# Altium project RHR075_GFC_ECAT_DNET_RS485_ALL_rev5.PrjPcb
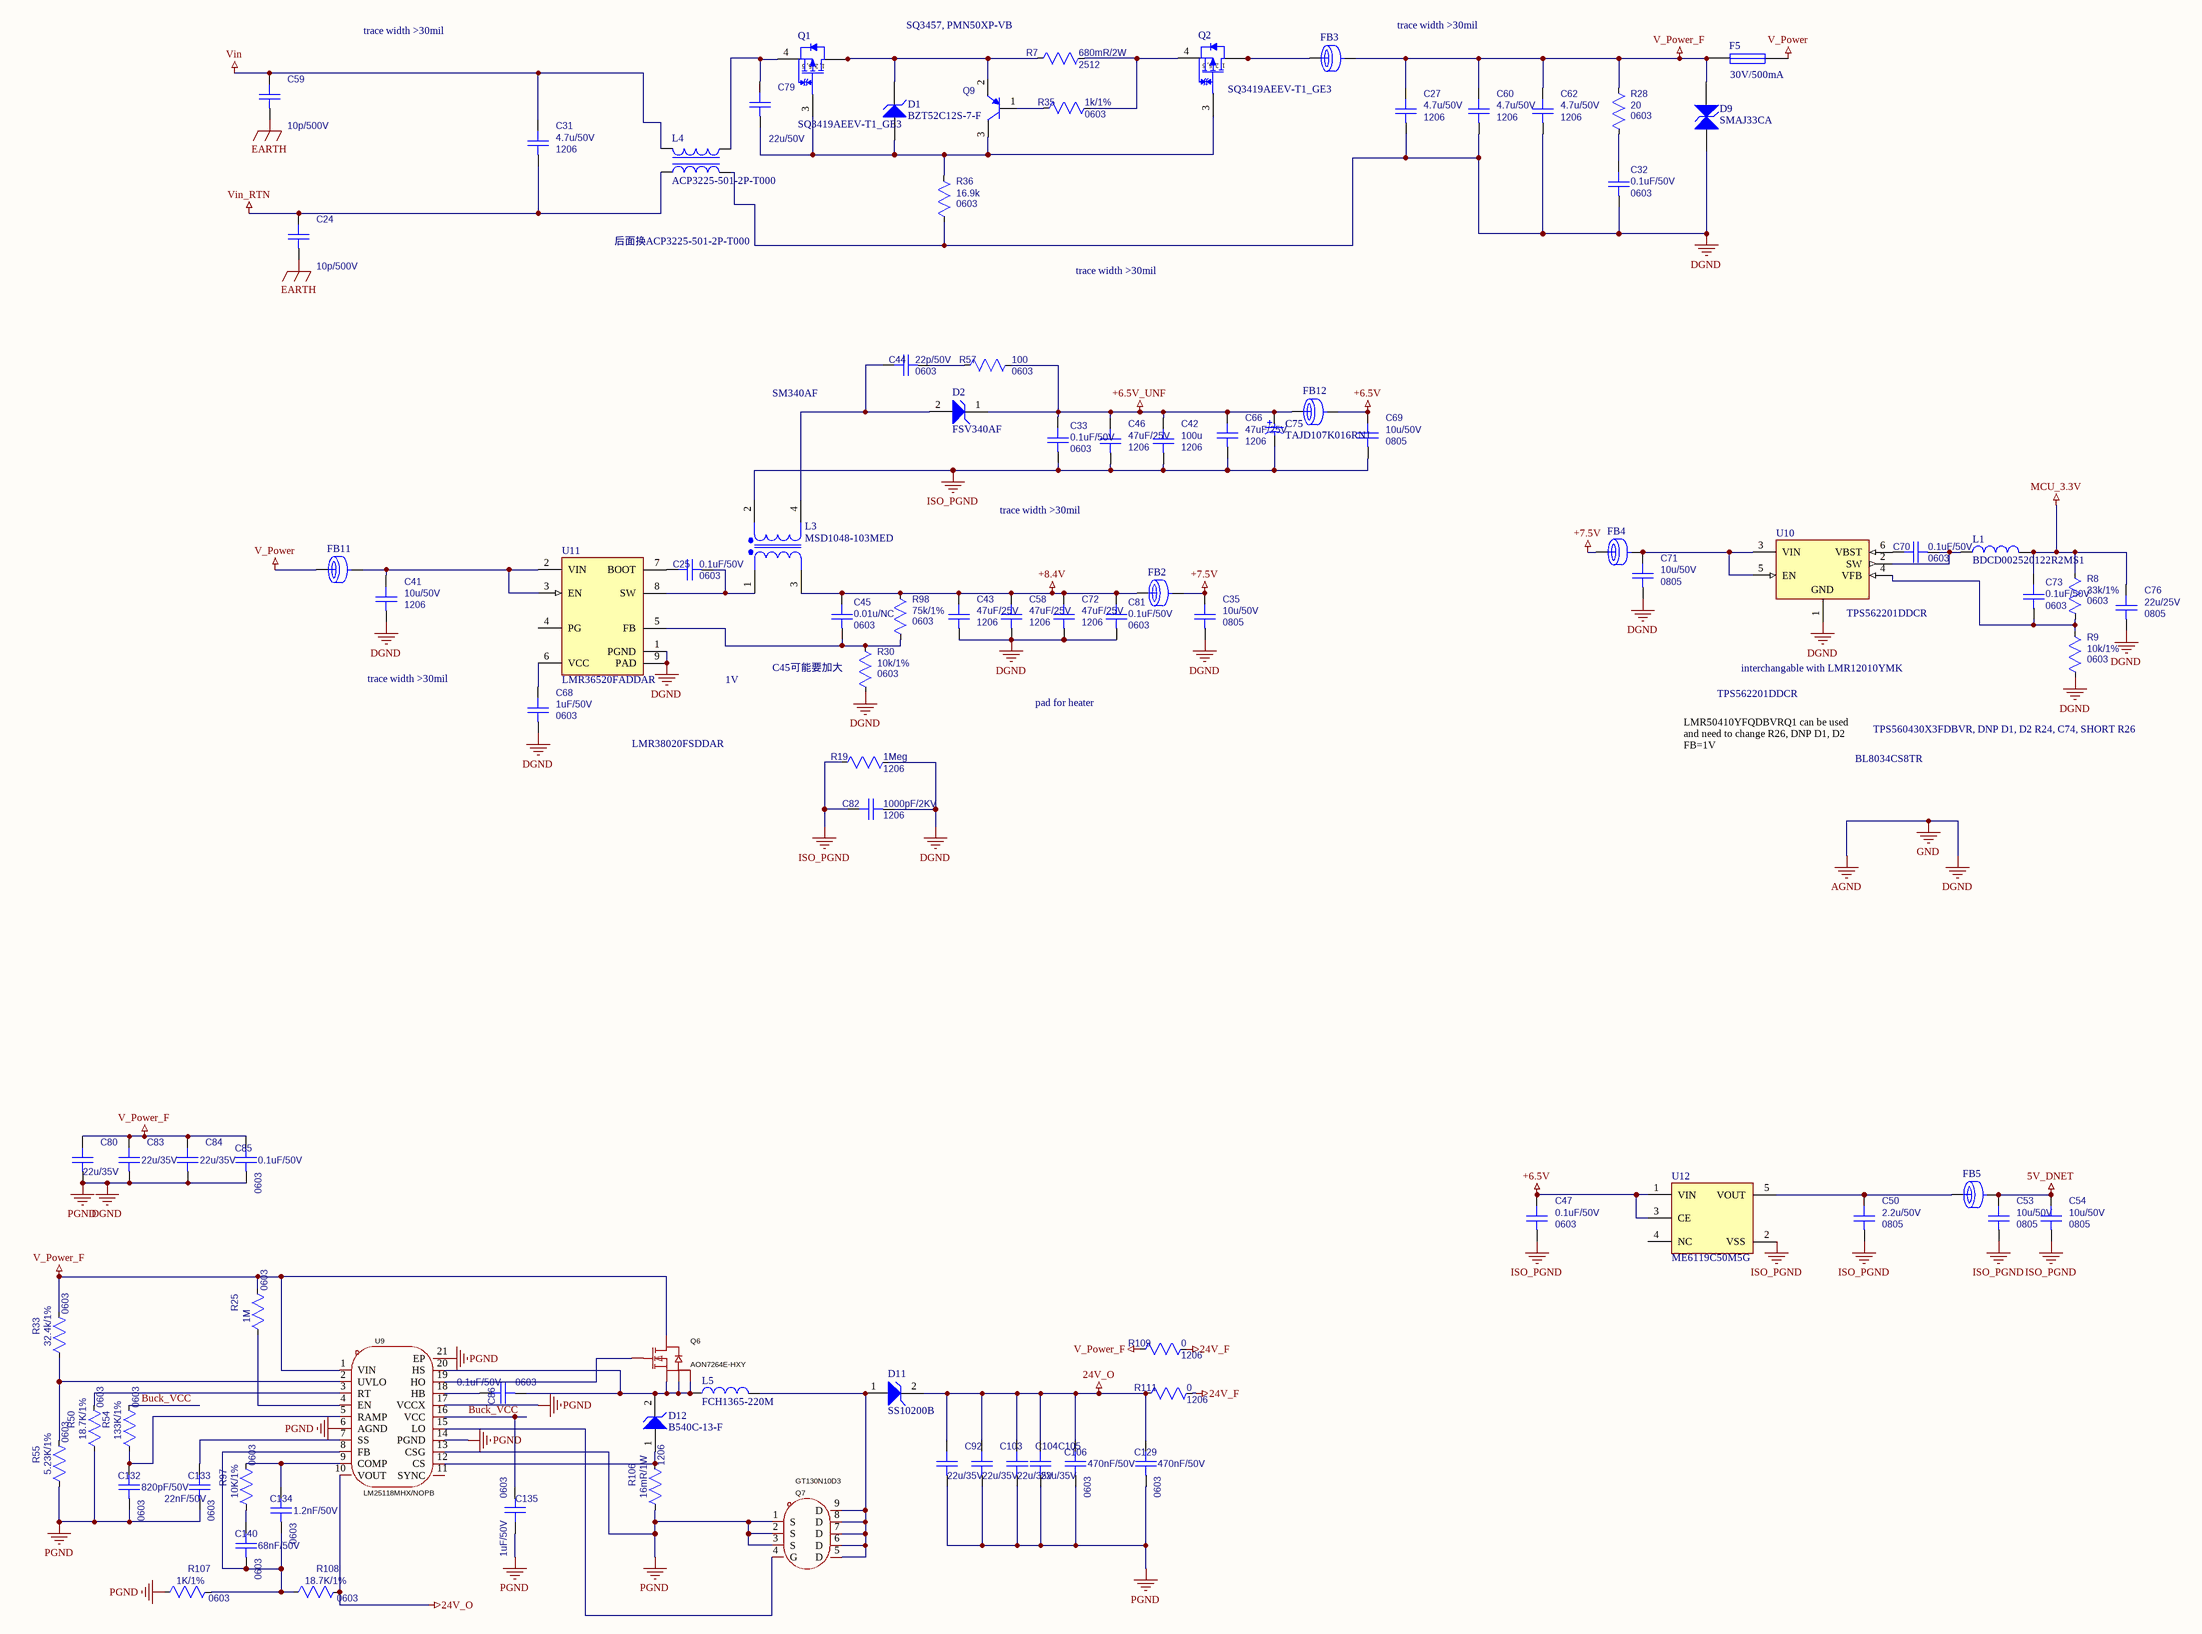
[diagram p0: POWER.SchDoc]
7 sheets, 225 parts. Net scope: global (net labels, ports and power ports of the same name join across sheets).
Board file: RHR075_GFC_ECAT_DNET_RS485_ALL_rev5.PcbDoc
Sheets:
  POWER.SchDoc
  CAN.SchDoc
  E_CAT.SchDoc
  RS485.SchDoc
  RS232.SchDoc
  connector.SchDoc
  ECAT RJ45.SchDoc

## Sheet POWER.SchDoc
size A1

### Parts
C24  10p/500V  [CAPC2012X127N_0805]
C25  Package: 0603  [CAPC1608X092N_0603]  (hidden comment: 0.1uF/50V)
C27  Package: 1206  [CAPC3216X156N_1206]  (hidden comment: 4.7u/50V)
C31  Package: 1206  [CAPC3216X156N_1206]  (hidden comment: 4.7u/50V)
C32  Package: 0603  [CAPC1608X092N_0603]  (hidden comment: 0.1uF/50V)
C33  Package: 0603  [CAPC1608X092N_0603]  (hidden comment: 0.1uF/50V)
C35  Package: 0805  [CAPC2012X127N_0805]  (hidden comment: 10u/50V)
C41  Package: 1206  [CAPC3216X156N_1206]  (hidden comment: 10u/50V)
C42  Package: 1206  [CAPC3216X156N_1206]  (hidden comment: 100u)
C43  Package: 1206  [CAPC3216X156N_1206]  (hidden comment: 47uF/25V)
C44  Package: 0603  [CAPC1608X092N_0603]  (hidden comment: 22p/50V)
C45  value 0.01u/NC  Package: 0603  [CAPC1608X092N_0603]  (hidden comment: 0.01uF/50V)  (no BOM)
C46  Package: 1206  [CAPC3216X156N_1206]  (hidden comment: 47uF/25V)
C47  Package: 0603  [CAPC1608X092N_0603]  (hidden comment: 0.1uF/50V)
C50  Package: 0805  [CAPC2012X127N_0805]  (hidden comment: 2.2u/50V)
C53  Package: 0805  [CAPC2012X127N_0805]  (hidden comment: 10u/50V)
C54  Package: 0805  [CAPC2012X127N_0805]  (hidden comment: 10u/50V)
C58  Package: 1206  [CAPC3216X156N_1206]  (hidden comment: 47uF/25V)
C59  10p/500V  [CAPC2012X127N_0805]
C60  Package: 1206  [CAPC3216X156N_1206]  (hidden comment: 4.7u/50V)
C62  Package: 1206  [CAPC3216X156N_1206]  (hidden comment: 4.7u/50V)
C66  Package: 1206  [CAPC3216X156N_1206]  (hidden comment: 47uF/25V)
C68  Package: 0603  [CAPC1608X092N_0603]  (hidden comment: 1uF/50V)
C69  Package: 0805  [CAPC2012X127N_0805]  (hidden comment: 10u/50V)
C70  Package: 0603  [CAPC1608X092N_0603]  (hidden comment: 0.1uF/50V)
C71  Package: 0805  [CAPC2012X127N_0805]  (hidden comment: 10u/50V)
C72  Package: 1206  [CAPC3216X156N_1206]  (hidden comment: 47uF/25V)
C73  Package: 0603  [CAPC1608X092N_0603]  (hidden comment: 0.1uF/50V)  (no BOM)
C75  TAJD107K016RNJ  [AVX-TAJ-D-2_L]
C76  Package: 0805  [CAPC2012X127N_0805]  (hidden comment: 22u/25V)
C79  22u/50V  [2220c]
C80  22u/35V  [CAPC3216X156N_1206]
C81  Package: 0603  [CAPC1608X092N_0603]  (hidden comment: 0.1uF/50V)
C82  Package: 1206  [CAPC3216X156N_1206]  (hidden comment: 1000pF/2KV)
C83  22u/35V  [CAPC3216X156N_1206]
C84  22u/35V  [CAPC3216X156N_1206]
C85  Package: 0603  [CAPC1608X092N_0603]  (hidden comment: 0.1uF/50V)
C86  Package: 0603  [CAPC1608X092N_0603]  (hidden comment: 0.1uF/50V)
C92  22u/35V  [CAPC3216X156N_1206]
C103  22u/35V  [CAPC3216X156N_1206]
C104  22u/35V  [CAPC3216X156N_1206]
C105  22u/35V  [CAPC3216X156N_1206]
C106  Package: 0603  [CAPC1608X092N_0603]  (hidden comment: 470nF/50V)
C129  Package: 0603  [CAPC1608X092N_0603]  (hidden comment: 470nF/50V)
C132  Package: 0603  [CAPC1608X092N_0603]  (hidden comment: 820pF/50V)
C133  Package: 0603  [CAPC1608X092N_0603]  (hidden comment: 22nF/50V)
C134  Package: 0603  [CAPC1608X092N_0603]  (hidden comment: 1.2nF/50V)
C135  Package: 0603  [CAPC1608X092N_0603]  (hidden comment: 1uF/50V)
C140  Package: 0603  [CAPC1608X092N_0603]  (hidden comment: 68nF/50V)
D1  BZT52C12S-7-F  [DIOD-SOD323-2_V]
D2  FSV340AF  [ONSC-SMA-FL-2-403AD_V]
D9  SMAJ33CA  [LFUS-DO-214AC-A-2_N]
D11  SS10200B  [SMB]
D12  B540C-13-F  [SMC]
F5  30V/500mA  [RESC3216X070N_1206]
FB2  FBC0603  [FBC0603]  (value not drawn)
FB3  BLM31PG121SN1L  [RESC3216X070N_1206]  (value not drawn)
FB4  FBC0603  [FBC0603]  (value not drawn)
FB5  FBC0603  [FBC0603]  (value not drawn)
FB11  FBC0603  [FBC0603]  (value not drawn)
FB12  FBC0603  [FBC0603]  (value not drawn)
L1  BDCD002520122R2MS1  [PULS-BDCD00252012_V]
L3  MSD1048-103MED  [COIL-MSD1048-4_V]
L4  ACP3225-501-2P-T000  [TDK-ACP3225-4_V]
L5  FCH1365-220M  [FNGCH-FCH1365-2_V]
Q1  SQ3419AEEV-T1_GE3  [VISH-TSOP-6_V]
Q2  SQ3419AEEV-T1_GE3  [VISH-TSOP-6_V]
Q6  AON7264E-HXY  [WDFN-5_L3.3-W3.3-P0.65-BL]
Q7  GT130N10D3  [PPAK3X3_L3.2-W3.1-P0.65-LS3.3-BL]
Q9  MMBT4403-7-F  [SOT-23_3N_95P_240x300x100]  (value not drawn)
R7  Package: 2512  [RESC6331X070N_2512]  (hidden comment: 680mR/2W)
R8  Package: 0603  [RESC1608X055N_0603]  (hidden comment: 33k/1%)
R9  Package: 0603  [RESC1608X055N_0603]  (hidden comment: 10k/1%)
R19  Package: 1206  [RESC3216X070N_1206]  (hidden comment: 1Meg)
R25  1M  Package: 0603  [RESC1608X055N_0603]
R28  Package: 0603  [RESC1608X055N_0603]  (hidden comment: 20)
R30  Package: 0603  [RESC1608X055N_0603]  (hidden comment: 10k/1%)
R33  32.4k/1%  Package: 0603  [RESC1608X055N_0603]
R35  Package: 0603  [RESC1608X055N_0603]  (hidden comment: 1k/1%)
R36  Package: 0603  [RESC1608X055N_0603]  (hidden comment: 16.9k)
R50  18.7K/1%  Package: 0603  [RESC1608X055N_0603]
R54  133K/1%  Package: 0603  [RESC1608X055N_0603]
R55  5.23K/1%  Package: 0603  [RESC1608X055N_0603]
R57  Package: 0603  [RESC1608X055N_0603]  (hidden comment: 100)
R97  10K/1%  Package: 0603  [RESC1608X055N_0603]
R98  Package: 0603  [RESC1608X055N_0603]  (hidden comment: 75k/1%)
R106  16mR/1W  Package: 1206  [RESC3216X070N_1206]
R107  1K/1%  Package: 0603  [RESC1608X055N_0603]
R108  18.7K/1%  Package: 0603  [RESC1608X055N_0603]
R109  Package: 1206  [RESC3216X070N_1206]  (hidden comment: 0)
R111  Package: 1206  [RESC3216X070N_1206]  (hidden comment: 0)  (no BOM)
U9  LM25118MHX/NOPB  [HTSSOP-20_L6.5-W4.4-P0.65-LS6.4-BL-EP]
U10  TPS562201DDCR  [DDC0006A_L]
U11  LMR36520FADDAR  [DDA0008A_M]
U12  ME6119C50M5G  [MCRN-SOT23-5_V]

### Nets
5V_DNET: C53.1 C54.1 FB5.2
24V_F: R109.1 R111.1
24V_O: C92.1 C103.1 C104.1 C105.1 C106.1 C129.1 D11.2(K) R108.1 R111.2 U9.10(VOUT)
+6.5V: C47.1 C69.1 FB12.2 U12.1(VIN) U12.3(CE)
+6.5V_UNF: C33.1 C42.1 C46.1 C66.1 C75.1 D2.1(K) FB12.1 R57.1
+7.5V: C35.1 FB2.2 FB4.1
+8.4V: C43.1 C45.1 C58.1 C72.1 C81.1 FB2.1 L3.3 R98.2
AGND: C27.2 C32.2 C35.2 C41.2 C43.2 C58.2 C60.2 C62.2 C68.2 C71.2 C72.2 C76.2 C80.2 C81.2 C82.2 C83.2 C84.2 C85.2 C92.2 C103.2 C104.2 C105.2 C106.2 C129.2 C132.2 C133.2 C135.1 D9.1(A) L4.3 Q7.1(S) Q7.2(S) Q7.3(S) R9.1 R19.1 R30.1 R36.1 R50.2 R55.2 R106.2 R107.2 U9.6(AGND) U9.13(CSG) U9.14(PGND) U9.17(VCCX) U9.21(EP) U10.1(GND) U11.1(PGND) U11.9(PAD)  [also labelled DGND, GND, PGND]
EARTH: C24.2 C59.2
ISO_PGND: C33.2 C42.2 C46.2 C47.2 C50.2 C53.2 C54.2 C66.2 C69.2 C75.2 C82.1 L3.2 R19.2 U12.2(VSS)
MCU_3.3V: C73.1 C76.1 L1.2 R8.2
V_Power: F5.2 FB11.1
V_Power_F: C27.1 C60.1 C62.1 C80.1 C83.1 C84.1 C85.1 D9.2(A) F5.1 FB3.2 Q6.5(D) R25.1 R28.2 R33.1 R109.2 U9.1(VIN)
Vin: C31.1 C59.1 L4.1
Vin_RTN: C24.1 C31.2 L4.2
Buck_VCC: C135.2 R54.1 U9.16(VCC)
NetC25_1: C25.1 U11.7(BOOT)
NetC25_2: C25.2 L3.1 U11.8(SW)
NetC32_1: C32.1 R28.1
NetC41_1: C41.1 FB11.2 U11.2(VIN) U11.3(EN)
NetC44_1: C44.1 D2.2(A) L3.4
NetC44_2: C44.2 R57.2
NetC45_2: C45.2 R30.2 R98.1 U11.5(FB)
NetC50_1: C50.1 FB5.1 U12.5(VOUT)
NetC68_1: C68.1 U11.6(VCC)
NetC70_1: C70.1 U10.6(VBST)
NetC70_2: C70.2 L1.1 U10.2(SW)
NetC71_1: C71.1 FB4.2 U10.3(VIN) U10.5(EN)
NetC73_2: C73.2 R8.1 R9.2 U10.4(VFB)
NetC79_1: C79.1 L4.4 Q1.4(S)
NetC79_2: C79.2 D1.1(A) Q1.3(G) Q2.3(G) Q9.3(C) R36.2
NetC86_1: C86.1 U9.18(HB)
NetC86_2: C86.2 D12.2(K) L5.1 Q6.1(S) Q6.2(S) Q6.3(S) U9.20(HS)
NetC132_1: C132.1 R54.2 U9.5(RAMP)
NetC133_1: C133.1 U9.7(SS)
NetC134_1: C134.1 R97.1 U9.9(COMP)
NetC134_2: C134.2 C140.2 R107.1 R108.2 U9.8(FB)
NetC140_1: C140.1 R97.2
NetD1_2: D1.2(K) Q1.1(D) Q1.2(D) Q1.5(D) Q1.6(D) Q9.2(E) R7.2
NetD11_1: D11.1(A) L5.2 Q7.5(D) Q7.6(D) Q7.7(D) Q7.8(D) Q7.9(D)
NetD12_1: D12.1(A) R106.1 U9.12(CS)
NetFB3_1: FB3.1 Q2.1(D) Q2.2(D) Q2.5(D) Q2.6(D)
NetQ2_4: Q2.4(S) R7.1 R35.1
NetQ6_4: Q6.4(G) U9.19(HO)
NetQ7_4: Q7.4(G) U9.15(LO)
NetQ9_1: Q9.1(B) R35.2
NetR25_2: R25.2 U9.4(EN)
NetR33_2: R33.2 R55.1 U9.2(UVLO)
NetR50_1: R50.1 U9.3(RT)

Not connected (* = marked no-connect by the designer): U9 11(SYNC); U11 4(PG); U12 4(NC)

### Notes on the sheet
- trace width >30mil
- SQ3457, PMN50XP-VB
- 后面换ACP3225-501-2P-T000
- SM340AF
- 1V
- C45可能要加大
- interchangable with LMR12010YMK
- LMR38020FSDDAR
- pad for heater
- TPS562201DDCR
- TPS560430X3FDBVR, DNP D1, D2 R24, C74, SHORT R26
- LMR50410YFQDBVRQ1 can be used and need to change R26, DNP D1, D2
  FB=1V
- BL8034CS8TR
- (in symbol SQ3419AEEV-T1_GE3) 1, 2, 5, 6

### Library data of the parts
C24 C59 = Capacitor_0805: PartNumber: CC0805JRNPOBBN100; Tolerance: [tol]; TempCo: [tempco]; Voltage Rating: [voltage]; Power Rating: *; Package: 0805; Value: 10p/500V; SupplierDescription: CAP CER 10PF 500V C0G/NP0 0805
C25 C32 C33 C47 C70 C81 = Capacitor_0603: PartNumber: CC0603KRX7R9BB104; Tolerance: [tol]; TempCo: [tempco]; Voltage Rating: [voltage]; Value: 0.1uF/50V; SupplierDescription: CAP CER 0.1UF 50V X7R 0603
  C25 C32 C33 C47 C81: Power Rating: *
  C70: Supplier 1: *; Supplier Part Number 1: *
C27 C31 C60 C62 = Capacitor_1206: PartNumber: CL31B475KBHNNNE; Tolerance: [tol]; TempCo: [tempco]; Voltage Rating: [voltage]; Power Rating: *; Value: 4.7u/50V; SupplierDescription: CAP CER 4.7UF 50V X7R 1206
C35 C53 C54 C69 C71 = Capacitor_0805: PartNumber: CL21A106KBYQNNE; Tolerance: [tol]; TempCo: [tempco]; Voltage Rating: [voltage]; Power Rating: *; Value: 10u/50V; SupplierDescription: CAP CER 10UF 10V X5R 0805
C41 = Capacitor_1206: PartNumber: CL31A106KBHNNNE; Tolerance: [tol]; TempCo: [tempco]; Voltage Rating: [voltage]; Power Rating: *; Value: 10u/50V; SupplierDescription: CAP CER 10UF 25V X5R 1206
C42 = Capacitor_1206: PartNumber: GRM31CR61A107MEA8L; Tolerance: [tol]; TempCo: [tempco]; Voltage Rating: [voltage]; Power Rating: *; Value: 100u; SupplierDescription: CAP CER 100UF 10V X5R 1206
C43 C46 C58 C66 C72 = Capacitor_1206: PartNumber: GRM31CR61E476ME44L; Tolerance: [tol]; TempCo: [tempco]; Voltage Rating: [voltage]; Power Rating: *; Value: 47uF/25V; SupplierDescription: CAP CER 100UF 10V X5R 1206
C44 = Capacitor_0603: PartNumber: C0603C220J1GACTU; Tolerance: [tol]; TempCo: [tempco]; Voltage Rating: [voltage]; Power Rating: *; Value: 22p/50V; SupplierDescription: CAP CER 22PF 100V C0G/NP0 0603
C45 = Capacitor_0603: PartNumber: 0603B103K500NT; Tolerance: [tol]; TempCo: [tempco]; Voltage Rating: [voltage]; Power Rating: *; SupplierDescription: CAP CER 10000PF 50V X7R 0603
C50 = Capacitor_0805: PartNumber: CC0805KKX7R9BB225; Tolerance: [tol]; TempCo: [tempco]; Voltage Rating: [voltage]; Power Rating: *; Value: 2.2u/50V; SupplierDescription: CAP CER 2.2UF 25V X7R 0805
C68 = Capacitor_0603: PartNumber: CL10A105KB8NNNC; Tolerance: [tol]; TempCo: [tempco]; Voltage Rating: [voltage]; Supplier 1: *; Supplier Part Number 1: *; Value: 1uF/50V; SupplierDescription: CAP CER 1UF 25V X5R 0603
C73 = Capacitor_0603: Tolerance: [tol]; TempCo: [tempco]; Voltage Rating: [voltage]; Power Rating: *; Value: 0.1uF/50V; SupplierDescription: CAP CER 10000PF 50V X7R 0603
C75 = TAJD107K016RNJ: Product Diameter (mm): NotRequiredmm; Product Length (mm): 7.3mm; Polarity: Polar; Rad Hardened: No; Wire Form: NotRequired; Product Height (mm): 2.9mm; Product Depth (mm): 4.3mm; Tolerance: ±10%; Voltage Rating (DC): 16V; Operating Temp Range: -55Cto125C; Packaging: TapeandReel; Seated Plane Height: NotRequiredmm; Seal: NotRequired; Mounting Style: SurfaceMount; Package / Case: 7343-31; Package Reference: TAJ-D-2; Publisher: Bolgen Studio; Value: TAJD107K016RNJ; PartNumber: TAJD107K016RNJ
C76 = Capacitor_0805: PartNumber: CL21A226MAYNNNE; Tolerance: [tol]; TempCo: [tempco]; Voltage Rating: [voltage]; Supplier 1: *; Supplier Part Number 1: *; Value: 22u/25V; SupplierDescription: CAP CER 22UF 10V X5R 0805
C79 = Capacitor_1206: Capacitor, MLCC; Manufacturer: KEMET; PartNumber: FS55X226K500EHG; Voltage Rating: [voltage]; Package: 2220; Value: 22u/50V
C80 C83 C84 C92 C103-C105 = Capacitor_1206: Capacitor, MLCC; Manufacturer: KEMET; PartNumber: C3216X5R1V226MTJ00E; Voltage Rating: [voltage]; Package: 1206; Value: 22u/35V
C82 = Capacitor_1206: PartNumber: CC1206KKX7RDBB102; Tolerance: [tol]; TempCo: [tempco]; Voltage Rating: [voltage]; Power Rating: *; Value: 1000pF/2KV; SupplierDescription: CAP CER 1000PF 1KV X7R 1206
C85 C86 = Capacitor_0603: Capacitor, MLCC; Manufacturer: KEMET; PartNumber: CC0603KRX7R9BB104; Voltage Rating: [voltage]; Value: 0.1uF/50V
C106 C129 C132-C134 C140 = Capacitor_0603: Capacitor, MLCC; Manufacturer: KEMET; Voltage Rating: [voltage]
  C106 C129: Value: 470nF/50V
  C132: Value: 820pF/50V
  C133: Value: 22nF/50V
  C134: Value: 1.2nF/50V
  C140: Value: 68nF/50V
C135 = Capacitor_0603: Capacitor, MLCC; Manufacturer: KEMET; PartNumber: CL10A105KB8NNNC; Voltage Rating: [voltage]; Value: 1uF/50V
D1 = BZT52C12S-7-F: Zener Current: 5mA; Vz - Zener Voltage: 12V; Pd - Power Dissipation: 200mW; Zz - Zener Impedance: 40Ohms; Unit Weight: 0.000173oz; Voltage Temperature Coefficient: 0.25mV/C; Voltage Tolerance: 5%; Package Reference: SOD323-2; Minimum Operating Temperature: -65C; Packaging: Reel; Product Category: ZenerDiodes; Termination Style: SMD/SMT; Mounting Style: SMD/SMT; RoHS: True; Package / Case: SOD-323; Package Description: 2-Pin Surface Mount Device, Body 1.7 x 1.3 mm; Width: 1.4mm; Mounting Technology: SurfaceMount; Package URL: http://www.vishay.com/docs/71192/71192.pdf; Series: BZT52C12; Value: BZT52C12S-7-F; PartNumber: BZT52C12S
D2 = FSV340AF: PartNumber: SM340AF; PPK Max (W): 600; Packing: Tape and Reel; V(BR) Typ (V): 6.7; PackageReference: SMA-FL-2-403AA-01; RoHS: Pb-Free; PackageDescription: 2-Pin Small Molded Package, Body 2.6 x 4.3 mm; Mounting Technology: Surface Mount; PackageVersion: Rev. O, 03/2011; Value: FSV340AF
D9 = SMAJ12CA: Power Dissipation: 400W; Mounting Technology: SurfaceMount; Package Description: 2-Pin Surface Mount Device, Body 4.295 x 2.595 mm; Package Reference: DO-214AC; Value: SMAJ33CA; PartNumber: SMAJ33CA
D11 D12 = FSV340AF: Schottky Barrier Rectifier, 40 V, 2-Pin SMA-FL, Pb-Free, Tape and Reel; Manufacturer: On Semiconductor
  D11: PartNumber: SS10200B; Value: SS10200B
  D12: PartNumber: B540C-13-F; Value: B540C-13-F
F5 = Fuse 1: PartNumber: BSMD1206-050-30V; Published: 8-Jun-2000; PackageReference: PIN-W2/E2.8; Publisher: Altium Limited; PackageDescription: Thru-Hole; 2 Leads; Value: 30V/500mA
FB2 FB4 FB5 FB11 FB12 = FBC0603: PartNumber: BLM18AG601SN1D; Value: 600 Ohms @ 100MHz; SupplierDescription: FERRITE BEAD 600 OHM 0603 1LN
FB3 = FBC0603: Value: BLM31PG121SN1L; PartNumber: BLM31PG121SN1L; SupplierDescription: FERRITE BEAD 600 OHM 0603 1LN
L1 = BDCD002520122R2MS1: Type: Wirewound; Online Catalog: VLSSeries; Tolerance: ±20%; Shielding: Shielded; Package Description: 2-Pin Surface Mount Device, Body 10 x 9.7 mm; Standard Package: 500; Package / Case: Nonstandard; Mounting Technology: SurfaceMount; Series: VLF; Operating Temperature: -40°C~105°C; Package Reference: VLS252012; Packaging: Tape&Reel(TR); Mounting Type: SurfaceMount; Value: BDCD002520122R2MS1; PartNumber: BDCD002520122R2MS1
L3 = MSD1048-103MED: SRF (MHz): 22; One Winding (A): 0.58; Tolerance: +/- 10%; Packing: Tape and Reel; PackageDescription: 4-Pin SMD, Body 10.3 x 10.3 mm, Height 4.8 mm; Mounting Technology: Surface Mount; RoHS: TRUE; PartNumber: MSD1048-103MED; PackageReference: MSD1048-4; Value: MSD1048-103MED
L4 = ACP3225-501-2P-T000: PartNumber: AD8615AUJZ-R2; Online Catalog: ACPSeries; Other Names: 445-8637-6; Number of Lines: 2; Package Description: 4-Pin Surface Mount Device, Body 3.2 x 2.5 mm, Pitch 1.15 mm; Package / Case: 1210(3225Metric),4Lead; Packaging: Digi-Reel; Operating Temperature: -40degC~85degC; Size / Dimension: 0.126"Lx0.098"W(3.20mmx2.50mm); Standard Package: 1; Series: ACP; Mounting Type: SurfaceMount; Package Reference: ACP3225-102-2P-T000-4; Value: ACP3225-501-2P-T000
L5 = FXL0630-100-M: Wire Wound Molded SMD Power Inductor, 10 uH, +/- 20%, -40 to 105 degC, 2-Pin SMD (0630), RoHS, Tape and Reel; Manufacturer: CJiang Technology; Value: FCH1365-220M; PartNumber: FCH1365-220M
Q1 Q2 = SQ3419AEEV-T1_GE3: PartNumber: PMN50XP-VB; Rated Power Dissipation: 2W; Qg Gate Charge: 25nC; Package Description: 6-Pin Thin Small Outline Package, Body 3 x 1.65 mm, Pitch 1.00 mm; Mounting Technology: SurfaceMount; Package Reference: TSOP-6; Value: SQ3419AEEV-T1_GE3
Q6 = AON7264E-HXY: Manufacturer: HXY MOSFET(华轩阳电子); Value: AON7264E-HXY; PartNumber: AON7264E-HXY
Q7 = GT700P08D3: Manufacturer: GOFORD(谷峰); Value: GT130N10D3; PartNumber: GT130N10D3
Q9 = OEM_Diodes_MMBT4403: Supplier 1: *; Supplier Part Number 1: *; Value: MMBT4403-7-F; PartNumber: MMBT4403-7-F
R7 R109 R111 = Resistor_2512: Power Rating: [power]; TempCo: [tempco]; Tolerance: tol; SupplierDescription: RES 0.68 OHM 5% 1W 2512
  R7: Value: 680mR/2W
  R109 R111: Value: 0
R8 = Resistor_0603: PartNumber: RC0603FR-0733KL; Power Rating: [power]; TempCo: [tempco]; Tolerance: tol; Value: 33k/1%; SupplierDescription: RES SMD 33K OHM 1% 1/10W 0603
R9 R30 = Resistor_0603: PartNumber: RC0603FR-0710KL; Power Rating: [power]; TempCo: [tempco]; Tolerance: tol; Value: 10k/1%; SupplierDescription: RES SMD 10K OHM 1% 1/10W 0603
R19 = Resistor_1206: PartNumber: RC1206FR-071ML; Power Rating: [power]; TempCo: [tempco]; Tolerance: tol; Value: 1Meg; SupplierDescription: RES SMD 1M OHM 1% 1/4W 1206
R25 R33 R50 R54 R55 R106 R108 = Resistor_0603: Resistor, Standard; Manufacturer: Yageo
  R25: Value: 1M
  R33: Value: 32.4k/1%
  R50 R108: Value: 18.7K/1%
  R54: Value: 133K/1%
  R55: Value: 5.23K/1%
  R106: Value: 16mR/1W
R28 = Resistor_0603: PartNumber: RK73H1JTTD16R0F; Power Rating: [power]; TempCo: [tempco]; Tolerance: tol; Value: 20; SupplierDescription: RES SMD 20 OHM 1% 1/8W 0603
R35 = Resistor_0603: PartNumber: RC0603FR-071KL; Power Rating: [power]; TempCo: [tempco]; Tolerance: tol; Value: 1k/1%; SupplierDescription: RES SMD 1K OHM 1% 1/10W 0603
R36 = Resistor_0603: PartNumber: FRC0603F1692TS; Power Rating: [power]; TempCo: [tempco]; Tolerance: tol; Value: 16.9k; SupplierDescription: RES SMD 16.9K OHM 1% 1/10W 0603
R57 = Resistor_0603: PartNumber: RT0603BRD07100RL; Power Rating: [power]; TempCo: [tempco]; Tolerance: tol; Value: 100; SupplierDescription: RES SMD 100 OHM 1% 1/10W 0603
R97 = Resistor_0603: Resistor, Standard; Manufacturer: Yageo; PartNumber: RC0603FR-0710KL; Value: 10K/1%
R98 = Resistor_0603: PartNumber: 0603WAF7502T5E; Power Rating: [power]; TempCo: [tempco]; Tolerance: tol; Value: 75k/1%; SupplierDescription: RES SMD 75K OHM 1% 1/10W 0603
R107 = Resistor_0603: Resistor, Standard; Manufacturer: Yageo; PartNumber: RC0603FR-071KL; Value: 1K/1%
U9 = LM25118MHX/NOPB: Manufacturer: TI(德州仪器); Value: LM25118MHX/NOPB; PartNumber: LM25118MHX/NOPB
U10 = TPS562201DDCR: Shielding: Unshielded; Resistance: 50 Ohm; RoHSCompliant: true; PackageDescription: 6-Pin Small Outline Transistor, Body 2.9 x 1.6 mm, Pitch 0.95 mm; Mount: Surface Mount; Min Operating Temperature: -40 degC; Pins: 5; Package Quantity: 1; Packaging: Cut Tape; Width: 1.01 mm; PackageReference: DDC0006A; Value: TPS562201DDCR; PartNumber: TPS562201DDCR
U12 = ME6119C50M5G: Number of Regulators: 1; Output Current: 300mA; Min Input Voltage: 2.5V; Nominal Output Voltage: 3.3V; Min Current Limit: 400mA; Number of Pins: 5; RoHSCompliant: True; Min Operating Temperature: -40degC; Package Description: 5-Pin Small Outline Transistor, Body 1.6 x 2.9 mm, Pitch 0.95 mm; Packaging: CutTape; Package Reference: SOT-23; Mount: SurfaceMount; Output Voltage: 3.3V; Mounting Technology: SurfaceMount; REACH SVHC: NoSVHC; Value: ME6119C50M5G; PartNumber: ME6119C50M5G
U11 = LMR36520FADDAR: Publisher: Bolgen Studio; Value: LMR36520FADDAR; PartNumber: LMR36520FADDAR

## Sheet CAN.SchDoc
size A3
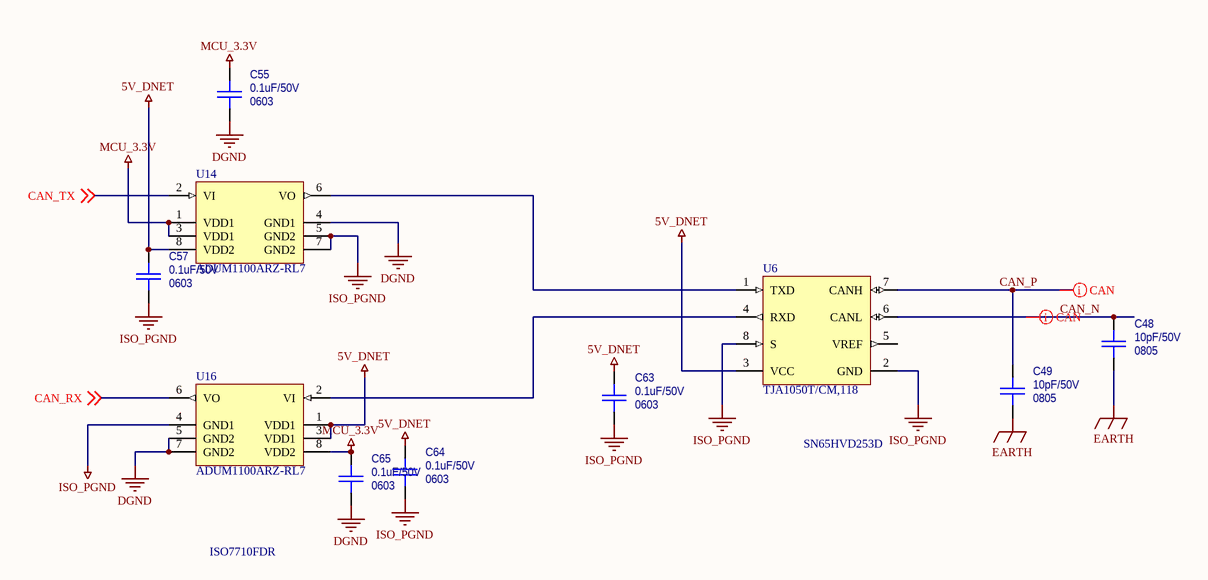
[diagram p1: CAN.SchDoc]

### Parts
C48  Package: 0805  [CAPC2012X127N_0805]  (hidden comment: 10pF/50V)  (no BOM)
C49  Package: 0805  [CAPC2012X127N_0805]  (hidden comment: 10pF/50V)  (no BOM)
C55  Package: 0603  [CAPC1608X092N_0603]  (hidden comment: 0.1uF/50V)  (no BOM)
C57  Package: 0603  [CAPC1608X092N_0603]  (hidden comment: 0.1uF/50V)  (no BOM)
C63  Package: 0603  [CAPC1608X092N_0603]  (hidden comment: 0.1uF/50V)  (no BOM)
C64  Package: 0603  [CAPC1608X092N_0603]  (hidden comment: 0.1uF/50V)  (no BOM)
C65  Package: 0603  [CAPC1608X092N_0603]  (hidden comment: 0.1uF/50V)  (no BOM)
U6  TJA1050T/CM,118  [NXP-SOT96-1_N]  (no BOM)
U14  ADUM1100ARZ-RL7  [ADI-R-8_N]  (no BOM)
U16  ADUM1100ARZ-RL7  [ADI-R-8_N]  (no BOM)

### Nets
5V_DNET: C57.1 C63.1 C64.1 U6.3(VCC) U14.8(VDD2) U16.1(VDD1) U16.3(VDD1)
DGND: C55.2 C65.2 U14.4(GND1) U16.5(GND2) U16.7(GND2)  [project net AGND]
EARTH: C48.2 C49.2
ISO_PGND: C57.2 C63.2 C64.2 U6.2(GND) U6.8(S) U14.5(GND2) U14.7(GND2) U16.4(GND1)
MCU_3.3V: C55.1 C65.1 U14.1(VDD1) U14.3(VDD1) U16.8(VDD2)
CAN_N: C48.1 U6.6(CANL)
CAN_P: C49.1 U6.7(CANH)
CAN_RX: U16.6(VO) ; off-sheet CAN_RX
CAN_TX: U14.2(VI) ; off-sheet CAN_TX
NetU6_1: U6.1(TXD) U14.6(VO)
NetU6_4: U6.4(RXD) U16.2(VI)

Not connected (* = marked no-connect by the designer): U6 5(VREF)

### Layout directives
differential pair: CAN_N, CAN_P

### Notes on the sheet
- SN65HVD253D
- ISO7710FDR

### Library data of the parts
C48 C49 = Capacitor_0805: Tolerance: [tol]; TempCo: [tempco]; Voltage Rating: [voltage]; Power Rating: *; Value: 10pF/50V; SupplierDescription: CAP CER 10PF 500V C0G/NP0 0805
C55 C57 C63-C65 = Capacitor_0603: as C25 on sheet POWER; Supplier 1: *; Supplier Part Number 1: *; Value: 0.1uF/50V; SupplierDescription: CAP CER 0.1UF 50V X7R 0603
U6 = TJA1050T/CM,118: Number of Drivers/Receivers: 1/1; Product Training Modules: CANandLINBusTransceiver; Protocol: CAN; Receiver Hysteresis: 70mV; Minimum Quantity: Transceiver; Voltage - Supply: 4.75V~5.25V; Other Names: 568-10292-1; PCN Packaging: LighterPackingReels30/Mar/2014; PCN Obsolescence: TJA105028/Apr/2013 / MultipleDevices19/Apr/2013; Standard Package: 1; Package Reference: SOT96-1; Mounting Type: SurfaceMount; Package / Case: 8-SOIC(0.154",3.90mmWidth); Package Description: 8-Pin Small Outline Integrated Circuit, Body 4.9 x 3.9 mm, Pitch 1.27 mm; Package/Case: 8-SOIC(0.154",3.90mmWidth); Supplier Device Package: 8-SO; Quantity Available: CutTape(CT)AlternatePackaging; Type: Transceiver; Packaging: CutTape(CT); Value: TJA1050T/CM,118
U14 U16 = ADUM1100ARZ-RL7: Mounting Technology: Surface Mount; PartNumber: ADUM1100ARZ-RL7; PackageDescription: 8-Pin Standard Small Outline Package, Body 4.9 x 3.9 mm, Pitch 1.27 mm; PackageVersion: 060506-A, 06/2006; PackageReference: R-8; Value: ADUM1100ARZ-RL7

## Sheet E_CAT.SchDoc
size 431 x 279 mm; SheetNumber: 3; PageSetup: Record=PageOptions|CenterHorizontal=True|CenterVertical=True|PrintScale=0.96|XCorrection=1.00|YCorrection=1.00|PrintKind=1|BorderSize=5000000|LeftOffset=0|BottomOffset=0|Orientation=2|PaperLength=1000|PaperWidth=1000|Scale=100|PaperSource=258|PrintQuality=600|MediaType=1|DitherType=10|PaperKind=11x17|PrintScaleMode=1; CopyrightDate: 20xx
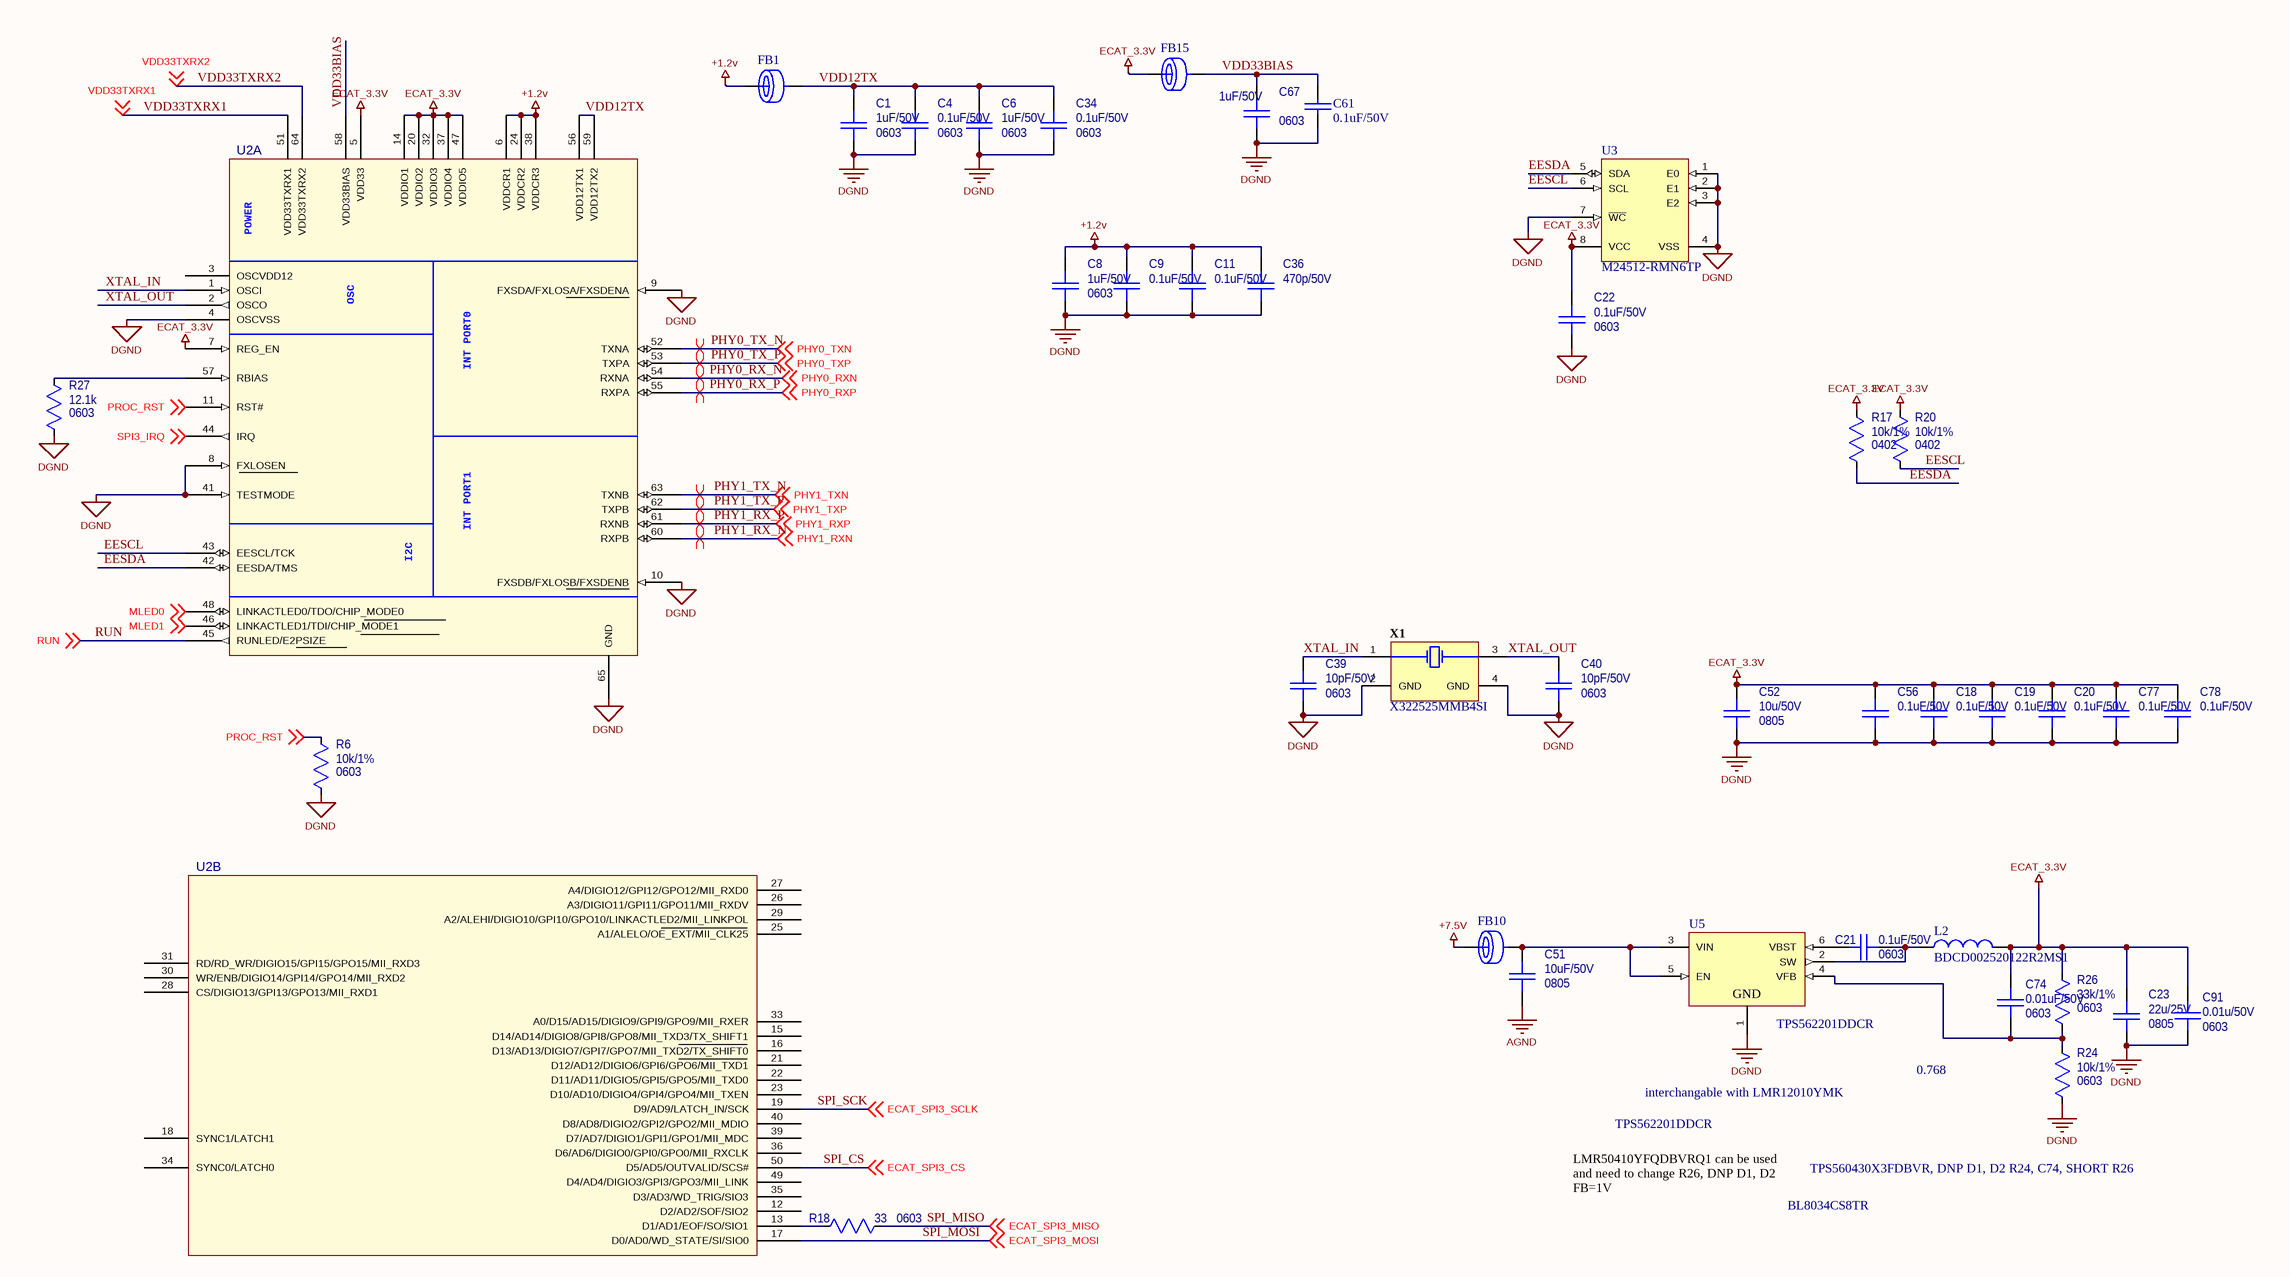
[diagram p2: E_CAT.SchDoc]

### Parts
C1  Package: 0603  [CAPC1608X092N_0603]  (hidden comment: 1uF/50V)
C4  Package: 0603  [CAPC1608X092N_0603]  (hidden comment: 0.1uF/50V)
C6  Package: 0603  [CAPC1608X092N_0603]  (hidden comment: 1uF/50V)
C8  Package: 0603  [CAPC1608X092N_0603]  (hidden comment: 1uF/50V)
C9  0.1uF/50V  [CAPC1608X092N_0603]
C11  0.1uF/50V  [CAPC1608X092N_0603]
C18  0.1uF/50V  [CAPC1608X092N_0603]
C19  0.1uF/50V  [CAPC1608X092N_0603]
C20  0.1uF/50V  [CAPC1608X092N_0603]
C21  Package: 0603  [CAPC1608X092N_0603]  (hidden comment: 0.1uF/50V)
C22  Package: 0603  [CAPC1608X092N_0603]  (hidden comment: 0.1uF/50V)
C23  Package: 0805  [CAPC2012X127N_0805]  (hidden comment: 22u/25V)
C34  Package: 0603  [CAPC1608X092N_0603]  (hidden comment: 0.1uF/50V)
C36  470p/50V  [CAPC1608X092N_0603]
C39  Package: 0603  [CAPC1608X092N_0603]  (hidden comment: 10pF/50V)
C40  Package: 0603  [CAPC1608X092N_0603]  (hidden comment: 10pF/50V)
C51  Package: 0805  [CAPC2012X127N_0805]  (hidden comment: 10uF/50V)
C52  Package: 0805  [CAPC2012X127N_0805]  (hidden comment: 10u/50V)
C56  0.1uF/50V  [CAPC1608X092N_0603]
C61  0.1uF/50V  [CAPC1608X092N_0603]
C67  Package: 0603  [CAPC1608X092N_0603]  (hidden comment: 1uF/50V)
C74  Package: 0603  [CAPC1608X092N_0603]  (hidden comment: 0.01uF/50V)
C77  0.1uF/50V  [CAPC1608X092N_0603]
C78  0.1uF/50V  [CAPC1608X092N_0603]
C91  Package: 0603  [CAPC1608X092N_0603]  (hidden comment: 0.01u/50V)
FB1  FBC0603  [FBC0603]  (value not drawn)
FB10  FBC0603  [FBC0603]  (value not drawn)
FB15  FBC0603  [FBC0603]  (value not drawn)
L2  BDCD002520122R2MS1  [PULS-BDCD00252012_V]
R6  Package: 0603  [RESC1608X055N_0603]  (hidden comment: 10k/1%)
R17  Package: 0402  [RESC1005X040N_0402]  (hidden comment: 10k/1%)
R18  Package: 0603  [RESC1608X055N_0603]  (hidden comment: 33)
R20  Package: 0402  [RESC1005X040N_0402]  (hidden comment: 10k/1%)
R24  Package: 0603  [RESC1608X055N_0603]  (hidden comment: 10k/1%)
R26  Package: 0603  [RESC1608X055N_0603]  (hidden comment: 33k/1%)
R27  Package: 0603  [RESC1608X055N_0603]  (hidden comment: 12.1k)
U2  LAN9252  [MCHP-QFN-64-6000x6000TP_V]  (value not drawn)  (parts A,B of 2)
U3  M24512-RMN6TP  [STM-SO8N_L]
U5  TPS562201DDCR  [DDC0006A_L]
X1  X322525MMB4SI  [TXC-7M-4_V]

### Nets
+1.2v: C8.1 C9.1 C11.1 C36.1 FB1.1 U2.6(VDDCR1) U2.24(VDDCR2) U2.38(VDDCR3)
+7.5V: FB10.1
AGND: C1.2 C4.2 C6.2 C8.2 C9.2 C11.2 C18.2 C19.2 C20.2 C22.2 C23.2 C34.2 C36.2 C39.2 C40.2 C51.2 C52.2 C56.2 C61.1 C67.2 C77.2 C78.2 C91.2 R6.1 R24.1 R27.1 U2.4(OSCVSS) U2.8(FXLOSEN) U2.9(FXSDA/FXLOSA/FXSDENA) U2.10(FXSDB/FXLOSB/FXSDENB) U2.41(TESTMODE) U2.65(GND) U3.1(E0) U3.2(E1) U3.3(E2) U3.4(VSS) U3.7(~{WC}) U5.1(GND) X1.2(GND) X1.4(GND)  [also labelled DGND]
ECAT_3.3V: C18.1 C19.1 C20.1 C22.1 C23.1 C52.1 C56.1 C74.1 C77.1 C78.1 C91.1 FB15.1 L2.2 R17.2 R20.2 R26.2 U2.5(VDD33) U2.7(REG_EN) U2.14(VDDIO1) U2.20(VDDIO2) U2.32(VDDIO3) U2.37(VDDIO4) U2.47(VDDIO5) U3.8(VCC)
EESCL: R20.1 U2.43(EESCL/TCK) U3.6(SCL)
EESDA: R17.1 U2.42(EESDA/TMS) U3.5(SDA)
MLED0: U2.48(LINKACTLED0/TDO/CHIP_MODE0) ; off-sheet MLED0
MLED1: U2.46(LINKACTLED1/TDI/CHIP_MODE1) ; off-sheet MLED1
PHY0_RX_N: U2.54(RXNA) ; off-sheet PHY0_RXN  [also labelled PHY0_RXN]
PHY0_RX_P: U2.55(RXPA) ; off-sheet PHY0_RXP  [also labelled PHY0_RXP]
PHY0_TX_N: U2.52(TXNA) ; off-sheet PHY0_TXN  [also labelled PHY0_TXN]
PHY0_TX_P: U2.53(TXPA) ; off-sheet PHY0_TXP  [also labelled PHY0_TXP]
PHY1_RX_N: U2.60(RXPB) ; off-sheet PHY1_RXN  [also labelled PHY1_RXN]
PHY1_RX_P: U2.61(RXNB) ; off-sheet PHY1_RXP  [also labelled PHY1_RXP]
PHY1_TX_N: U2.63(TXNB) ; off-sheet PHY1_TXN  [also labelled PHY1_TXN]
PHY1_TX_P: U2.62(TXPB) ; off-sheet PHY1_TXP  [also labelled PHY1_TXP]
PROC_RST: R6.2 U2.11(RST#) ; off-sheet PROC_RST
RUN: U2.45(RUNLED/E2PSIZE) ; off-sheet RUN
SPI3_IRQ: U2.44(IRQ) ; off-sheet SPI3_IRQ
SPI_CS: U2.50(D5/AD5/OUTVALID/SCS#) ; off-sheet ECAT_SPI3_CS  [also labelled ECAT_SPI3_CS]
SPI_MISO: R18.1 ; off-sheet ECAT_SPI3_MISO  [also labelled ECAT_SPI3_MISO]
SPI_MOSI: U2.17(D0/AD0/WD_STATE/SI/SIO0) ; off-sheet ECAT_SPI3_MOSI  [also labelled ECAT_SPI3_MOSI]
SPI_SCK: U2.19(D9/AD9/LATCH_IN/SCK) ; off-sheet ECAT_SPI3_SCLK  [also labelled ECAT_SPI3_SCLK]
VDD12TX: C1.1 C4.1 C6.1 C34.1 FB1.2 U2.56(VDD12TX1) U2.59(VDD12TX2)
VDD33BIAS: C61.2 C67.1 FB15.2 U2.58(VDD33BIAS)
VDD33TXRX1: U2.51(VDD33TXRX1) ; off-sheet VDD33TXRX1
VDD33TXRX2: U2.64(VDD33TXRX2) ; off-sheet VDD33TXRX2
XTAL_IN: C39.1 U2.1(OSCI) X1.1(X1)
XTAL_OUT: C40.1 U2.2(OSCO) X1.3(X2)
NetC21_1: C21.1 U5.6(VBST)
NetC21_2: C21.2 L2.1 U5.2(SW)
NetC51_1: C51.1 FB10.2 U5.3(VIN) U5.5(EN)
NetC74_2: C74.2 R24.2 R26.1 U5.4(VFB)
NetR18_2: R18.2 U2.13(D1/AD1/EOF/SO/SIO1)
NetR27_2: R27.2 U2.57(RBIAS)

Not connected (* = marked no-connect by the designer): U2 3(OSCVDD12) 12(D2/AD2/SOF/SIO2) 15(D14/AD14/DIGIO8/GPI8/GPO8/MII_TXD3/TX_SHIFT1) 16(D13/AD13/DIGIO7/GPI7/GPO7/MII_TXD2/TX_SHIFT0) 18(SYNC1/LATCH1) 21(D12/AD12/DIGIO6/GPI6/GPO6/MII_TXD1) 22(D11/AD11/DIGIO5/GPI5/GPO5/MII_TXD0) 23(D10/AD10/DIGIO4/GPI4/GPO4/MII_TXEN) 25(A1/ALELO/OE_EXT/MII_CLK25) 26(A3/DIGIO11/GPI11/GPO11/MII_RXDV) 27(A4/DIGIO12/GPI12/GPO12/MII_RXD0) 28(CS/DIGIO13/GPI13/GPO13/MII_RXD1) 29(A2/ALEHI/DIGIO10/GPI10/GPO10/LINKACTLED2/MII_LINKPOL) 30(WR/ENB/DIGIO14/GPI14/GPO14/MII_RXD2) 31(RD/RD_WR/DIGIO15/GPI15/GPO15/MII_RXD3) 33(A0/D15/AD15/DIGIO9/GPI9/GPO9/MII_RXER) 34(SYNC0/LATCH0) 35(D3/AD3/WD_TRIG/SIO3) 36(D6/AD6/DIGIO0/GPI0/GPO0/MII_RXCLK) 39(D7/AD7/DIGIO1/GPI1/GPO1/MII_MDC) 40(D8/AD8/DIGIO2/GPI2/GPO2/MII_MDIO) 49(D4/AD4/DIGIO3/GPI3/GPO3/MII_LINK)

### Layout directives
differential pair: PHY0_RX_N, PHY0_RX_P, PHY0_TX_N, PHY0_TX_P, PHY1_RX_N, PHY1_RX_P, PHY1_TX_N, PHY1_TX_P

### Notes on the sheet
- interchangable with LMR12010YMK
- 0.768
- TPS562201DDCR
- TPS560430X3FDBVR, DNP D1, D2 R24, C74, SHORT R26
- LMR50410YFQDBVRQ1 can be used and need to change R26, DNP D1, D2
  FB=1V
- BL8034CS8TR
- DWG. TITLE
- FILE NAME:
- OrangePrecision
- DWG. NO.
- REV.
- DATE PRINTED:
- ENG.
- DWN.
- DATE
- SHEET
- OF
- (in symbol LAN9252_QFN64, part A) POWER; OSC; INT PORT0; INT PORT1; I2C

### Library data of the parts
C1 C6 C8 C67 = Capacitor_0603: as C68 on sheet POWER; Supplier 1: *; Supplier Part Number 1: *; Value: 1uF/50V; SupplierDescription: CAP CER 1UF 25V X5R 0603
C4 C9 C11 C18-C20 C34 C56 C77 C78 = Capacitor_0402: PartNumber: CC0603KRX7R9BB104; Tolerance: [tol]; TempCo: [tempco]; Voltage Rating: [voltage]; Supplier 1: *; Supplier Part Number 1: *; Value: 0.1uF/50V; SupplierDescription: CAP CER 0.1UF 16V X7R 0402
  C9 C11 C18-C20 C56 C77 C78: Package: 0603
C21 C22 = Capacitor_0603: as C25 on sheet POWER; Supplier 1: *; Supplier Part Number 1: *; Value: 0.1uF/50V; SupplierDescription: CAP CER 0.1UF 50V X7R 0603
C23 = Capacitor_0805: as C76 on sheet POWER; Supplier 1: *; Supplier Part Number 1: *; Value: 22u/25V; SupplierDescription: CAP CER 22UF 10V X5R 0805
C36 = Capacitor_0402: PartNumber: CC0603KRX7R9BB471; Tolerance: [tol]; TempCo: [tempco]; Voltage Rating: [voltage]; Supplier 1: *; Supplier Part Number 1: *; Package: 0603; Value: 470p/50V; SupplierDescription: CAP CER 470PF 50V X7R 0402
C39 C40 = Capacitor_0603: PartNumber: CC0603JRNPO9BN100; Tolerance: [tol]; TempCo: [tempco]; Voltage Rating: [voltage]; Supplier 1: *; Supplier Part Number 1: *; Value: 10pF/50V; SupplierDescription: CAP CER 10PF 50V C0G/NPO 0603
C51 = Capacitor_0805: as C35 on sheet POWER; Power Rating: *; Value: 10uF/50V; SupplierDescription: CAP CER 10UF 10V X5R 0805
C52 = Capacitor_0603: PartNumber: GRM188R61A106KE69D; Tolerance: [tol]; TempCo: [tempco]; Voltage Rating: [voltage]; Supplier 1: *; Supplier Part Number 1: *; Value: 10u/50V; SupplierDescription: CAP CER 10UF 10V X5R 0603
C61 = CAP: PartNumber: CC0603KRX7R9BB104; Value: 0.1uF/50V; Package: 0603
C74 C91 = Capacitor_0603: as C45 on sheet POWER; Power Rating: *; SupplierDescription: CAP CER 10000PF 50V X7R 0603
  C74: Value: 0.01uF/50V
  C91: Value: 0.01u/50V
FB1 FB10 FB15 = FBC0603: as FB2 on sheet POWER; SupplierDescription: FERRITE BEAD 600 OHM 0603 1LN
L2 = BDCD002520122R2MS1: as L1 on sheet POWER; Package Description: 2-Pin Surface Mount Device, Body 10 x 9.7 mm; Standard Package: 500; Package / Case: Nonstandard; Mounting Technology: SurfaceMount; Series: VLF; Operating Temperature: -40°C~105°C; Package Reference: VLS252012; Packaging: Tape&Reel(TR); Mounting Type: SurfaceMount; Value: BDCD002520122R2MS1; PartNumber: BDCD002520122R2MS1
R6 = Resistor_0402: PartNumber: RC0603FR-0710KL; Power Rating: [power]; TempCo: [tempco]; Tolerance: tol; Value: 10k/1%; SupplierDescription: RES SMD 10K OHM 1% 1/10W 0402
R17 R20 = Resistor_0402: PartNumber: MR04X1002FTL; Power Rating: [power]; TempCo: [tempco]; Tolerance: tol; Value: 10k/1%; SupplierDescription: RES SMD 10K OHM 1% 1/10W 0402
R18 = Resistor_0402: PartNumber: RC0402FR-0733RL; Power Rating: [power]; TempCo: [tempco]; Tolerance: tol; Value: 33; SupplierDescription: RES SMD 33 OHM 1% 1/16W 0402
R24 = Resistor_0603: as R9 on sheet POWER; Value: 10k/1%; SupplierDescription: RES SMD 10K OHM 1% 1/10W 0603
R26 = Resistor_0603: as R8 on sheet POWER; Value: 33k/1%; SupplierDescription: RES SMD 33K OHM 1% 1/10W 0603
R27 = Resistor_0603: PartNumber: RS-03K1212FT; Power Rating: [power]; TempCo: [tempco]; Tolerance: tol; Value: 12.1k; SupplierDescription: RES 12.1K OHM 1% 1/10W 0603
U2 = LAN9252_QFN64: Populated: Yes; Owner: Manikandan; Supplier Part Number 1: LAN9252I/ML-ND; Supplier 1: Digikey; RoHS: Yes; Package: QFN64-9X9x1; Status: New; Value: LAN9252; PartNumber: LAN9252
U3 = M24512-RMN6TP: Supply Voltage Max: 5.5V; Memory Case Style: SOIC; SVHC: NoSVHC(17-Dec-2015); Memory Size: 512Kbit; Product Range: 32KbitSerialSPIEEPROMs; Supply Voltage Min: 1.8V; No. of Pins: 8Pins; Package Description: 8-Pin Small Outline Integrated Circuit, Body 4.9 x 3.9 mm, Pitch 1.27 mm; Operating Temperature Min: -40°C; Operating Temperature Max: 85°C; Mounting Technology: SurfaceMount; Packaging: Each; Package Reference: SO8N; MSL: -; Value: M24512-RMN6TP; PartNumber: M24512-RMN6TP
U5 = TPS562201DDCR: as U10 on sheet POWER; RoHSCompliant: true; PackageDescription: 6-Pin Small Outline Transistor, Body 2.9 x 1.6 mm, Pitch 0.95 mm; Mount: Surface Mount; Min Operating Temperature: -40 degC; Pins: 5; Package Quantity: 1; Packaging: Cut Tape; Width: 1.01 mm; PackageReference: DDC0006A; Value: TPS562201DDCR; PartNumber: TPS562201DDCR
X1 = 7M-25.000MEEQ-T: Operating Mode: Fundamental; Other Names: 887-1329-1; Mounting Technology: SurfaceMount; Type: MHzCrystal; Mounting Type: SurfaceMount; Series: 7M; Package Reference: 7M-4; Size / Dimension: 0.126"Lx0.098"W(3.20mmx2.50mm); Package Description: 4-Pin Surface Mount Device, Body 3.2 x 2.5 mm; Operating Temperature: -20°C~70°C; Packaging: CutTape(CT); Standard Package: 1; Package / Case: 4-SMD,NoLead(DFN,LCC); Value: X322525MMB4SI; PartNumber: X322525MMB4SI

## Sheet RS485.SchDoc
size A4
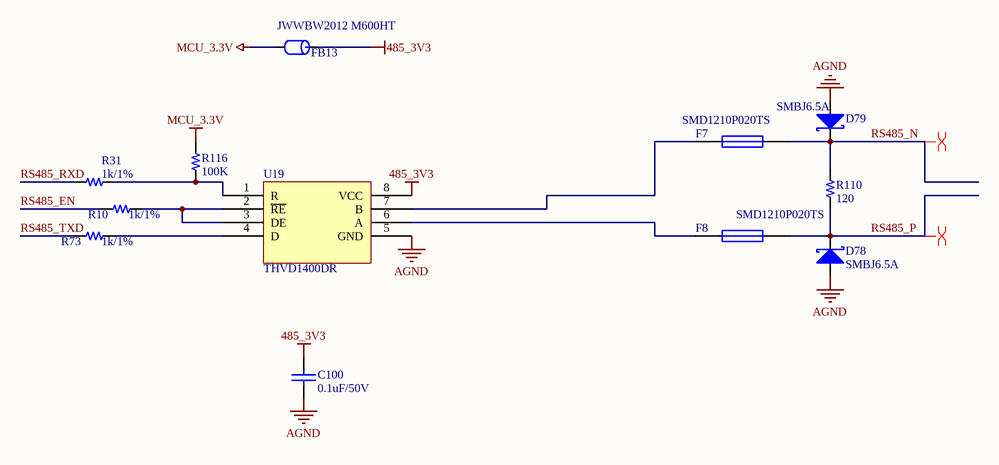
[diagram p3: RS485.SchDoc]

### Parts
C100  0.1uF/50V  [CAPC1608X092N_0603]
D78  SMBJ6.5A  [SMB]
D79  SMBJ6.5A  [SMB]
F7  SMD1210P020TS  [RESC3216X070N_1206]
F8  SMD1210P020TS  [RESC3216X070N_1206]
FB13  JWWBW2012 M600HT  [0805CZ]
R10  1k/1%  [RESC1608X055N_0603]
R31  1k/1%  [RESC1608X055N_0603]
R73  1k/1%  [RESC1608X055N_0603]
R110  120  [RESC1608X055N_0603]
R116  100K  [RESC1608X055N_0603]
U19  THVD1400DR  [so-8]

### Nets
485_3V3: C100.2 FB13.1 U19.8(VCC)
AGND: C100.1 D78.1(A) D79.1(A) U19.5(GND)
MCU_3.3V: FB13.2 R116.2
RS485_EN: R10.2
RS485_N: D79.2(K) F7.2 R110.1
RS485_P: D78.2(K) F8.2 R110.2
RS485_RXD: R31.2
RS485_TXD: R73.2
NetF7_1: F7.1 U19.7(B)
NetF8_1: F8.1 U19.6(A)
NetR10_1: R10.1 U19.2(~{RE}) U19.3(DE)
NetR31_1: R31.1 R116.1 U19.1(R)
NetR73_1: R73.1 U19.4(D)

### Layout directives
differential pair: RS485_N, RS485_P

### Library data of the parts
C100 = CAP: PartNumber: CC0603KRX7R9BB104; Value: 0.1uF/50V; Package: 0603
D78 D79 = DIODE S: Value: SMBJ6.5A; PartNumber: SMBJ6.5A
F7 F8 = Fuse 1: PartNumber: SMD1210-020; Published: 8-Jun-2000; PackageReference: PIN-W2/E2.8; Publisher: Altium Limited; Value: SMD1210P020TS
FB13 = FB: Part Field 1: 磁珠/0603/1K ohm/100MHz; PartNumber: BLM21PG221SN1D; Text Field1: FB; Value: JWWBW2012 M600HT; Package: 0805
R10 R31 R73 = R: PartNumber: RC0603FR-071KL; Value: 1k/1%; Package: 0603
R110 = R: PartNumber: RC0603FR-07120RL; Value: 120; Package: 0603
R116 = R: PartNumber: RC0603FR-07100KL; Value: 100K; Package: 0603
U19 = SN65HVD06D: PartNumber: BL3085; Value: THVD1400DR

## Sheet RS232.SchDoc
size A4
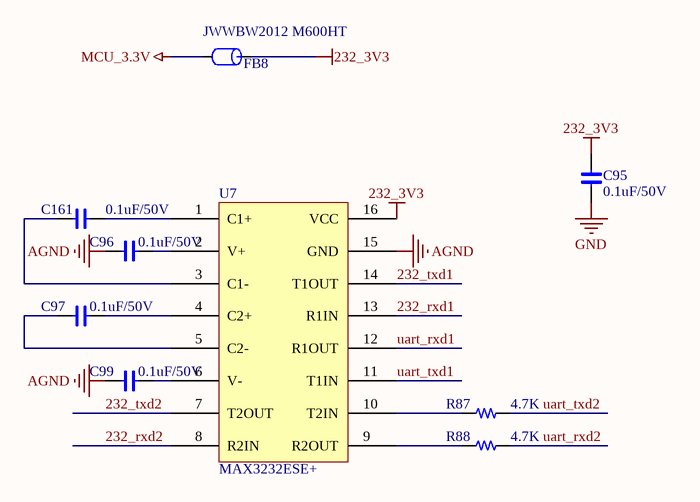
[diagram p4: RS232.SchDoc]

### Parts
C95  0.1uF/50V  [CAPC1608X092N_0603]
C96  0.1uF/50V  [CAPC1608X092N_0603]
C97  0.1uF/50V  [CAPC1608X092N_0603]
C99  0.1uF/50V  [CAPC1608X092N_0603]
C161  0.1uF/50V  [CAPC1608X092N_0603]
FB8  JWWBW2012 M600HT  [0805CZ]
R87  4.7K  [RESC1608X055N_0603]
R88  4.7K  [RESC1608X055N_0603]
U7  MAX3232ESE+  [SOIC127P600X265-16N]

### Nets
232_3V3: C95.1 FB8.1 U7.16(VCC)
AGND: C95.2 C96.2 C99.2 U7.15(GND)  [also labelled GND]
MCU_3.3V: FB8.2
232_rxd1: U7.13(R1IN)
232_rxd2: U7.8(R2IN)
232_txd1: U7.14(T1OUT)
232_txd2: U7.7(T2OUT)
uart_rxd1: U7.12(R1OUT)
uart_rxd2: R88.2
uart_txd1: U7.11(T1IN)
uart_txd2: R87.2
NetC96_1: C96.1 U7.2(V+)
NetC97_1: C97.1 U7.4(C2+)
NetC97_2: C97.2 U7.5(C2-)
NetC99_1: C99.1 U7.6(V-)
NetC161_1: C161.1 U7.1(C1+)
NetC161_2: C161.2 U7.3(C1-)
NetR87_1: R87.1 U7.10(T2IN)
NetR88_1: R88.1 U7.9(R2OUT)

### Library data of the parts
C95-C97 C99 C161 = C: PartNumber: CC0603KRX7R9BB104; Value: 0.1uF/50V; Package: 0603
FB8 = FB: as FB13 on sheet RS485; Text Field1: FB; Value: JWWBW2012 M600HT; Package: 0805
R87 R88 = R: PartNumber: RC0603FR-074K7L; Value: 4.7K; Package: 0603
U7 = MAX3232ESE+: Value: MAX3232ESE+; PartNumber: MAX3232ESE+

## Sheet connector.SchDoc
size A4; SPICEModelCacheDOTMRQIM: <root> / <DocumentId>DOTMRQIM</DocumentId> / <CacheFrame Number="0"> / <Model Name="npn" Kind="MDL"> / <Text>*Default NPN BJT / *NPN Trans Pinout: C,B,E / .MODEL NPN NPN()</Text> / </Model> / </CacheFrame> / </root>
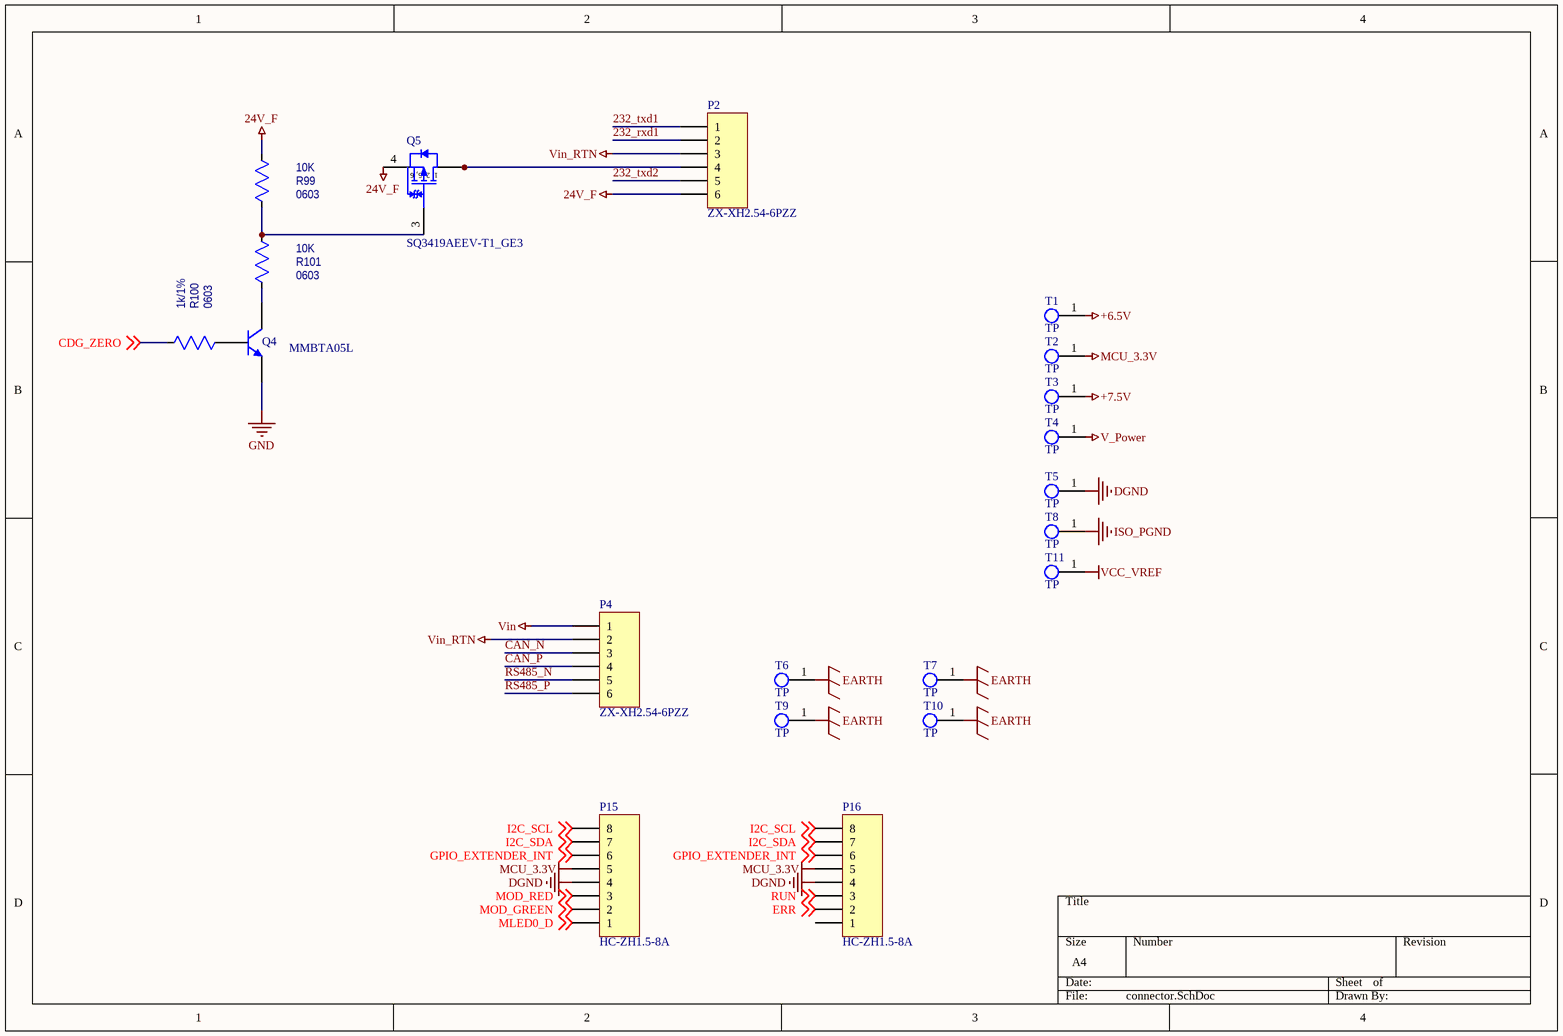
[diagram p5: connector.SchDoc]

### Parts
P2  ZX-XH2.54-6PZZ  [6X2.54MMZ]
P4  ZX-XH2.54-6PZZ  [6X2.54MMZ]
P15  HC-ZH1.5-8A  [CONN-TH_HC-ZH1.5-8A]
P16  HC-ZH1.5-8A  [CONN-TH_HC-ZH1.5-8A]
Q4  MMBTA05L  [sot23-3]
Q5  SQ3419AEEV-T1_GE3  [VISH-TSOP-6_V]  (no BOM)
R99  Package: 0603  [RESC1608X055N_0603]  (hidden comment: 10K)
R100  Package: 0603  [RESC1608X055N_0603]  (hidden comment: 1k/1%)
R101  Package: 0603  [RESC1608X055N_0603]  (hidden comment: 10K)
T1  TP  [TPD]
T2  TP  [TPD]
T3  TP  [TPD]
T4  TP  [TPD]
T5  TP  [TPD]
T6  TP  [FIX-4.5]
T7  TP  [FIX-4.5]
T8  TP  [TPD]
T9  TP  [FIX-4.5]
T10  TP  [FIX-4.5]
T11  TP  [TPD]

### Nets
24V_F: P2.6 Q5.4(S) R99.1
+6.5V: T1.1
+7.5V: T3.1
DGND: P15.4 P16.4 Q4.2(E) T5.1  [also labelled GND]  [project net AGND]
EARTH: T6.1 T7.1 T9.1 T10.1
ISO_PGND: T8.1
MCU_3.3V: P15.5 P16.5 T2.1
V_Power: T4.1
VCC_VREF: T11.1
Vin: P4.1
Vin_RTN: P2.3 P4.2
232_rxd1: P2.2
232_txd1: P2.1
232_txd2: P2.5
CAN_N: P4.3
CAN_P: P4.4
CDG_ZERO: R100.1 ; off-sheet CDG_ZERO
ERR: P16.2 ; off-sheet ERR
GPIO_EXTENDER_INT: P15.6 P16.6 ; off-sheet GPIO_EXTENDER_INT
I2C_SCL: P15.8 P16.8 ; off-sheet I2C_SCL
I2C_SDA: P15.7 P16.7 ; off-sheet I2C_SDA
MLED0_D: P15.1 ; off-sheet MLED0_D
MOD_GREEN: P15.2 ; off-sheet MOD_GREEN
MOD_RED: P15.3 ; off-sheet MOD_RED
RS485_N: P4.5
RS485_P: P4.6
RUN: P16.3 ; off-sheet RUN
NetP2_4: P2.4 Q5.1(D) Q5.2(D) Q5.5(D) Q5.6(D)
NetQ4_1: Q4.1(B) R100.2
NetQ4_3: Q4.3(C) R101.2
NetQ5_3: Q5.3(G) R99.2 R101.1

Not connected (* = marked no-connect by the designer): P16 1

### Notes on the sheet
- (in symbol SQ3419AEEV-T1_GE3) 1, 2, 5, 6

### Library data of the parts
P2 P4 = Header 6: Publisher: Altium Limited; Value: ZX-XH2.54-6PZZ; PartNumber: ZX-XH2.54-6PZZ
P15 P16 = Header 8: Header, 8-Pin; LatestRevisionDate: 17-Jul-2002; LatestRevisionNote: Re-released for DXP Platform.; Publisher: Altium Limited; Value: HC-ZH1.5-8A; PartNumber: HC-ZH1.5-8A
Q4 = NPN: NPN Bipolar Transistor; Published: 8-Jun-2000; LatestRevisionDate: 17-Jul-2002; LatestRevisionNote: Re-released for DXP Platform.; PackageReference: TO-226; Publisher: Altium Limited; Code_JEDEC: TO-226-AA; PartNumber: MMBTA05L
Q5 = SQ3419AEEV-T1_GE3: Automotive P-Channel MOSFET, 6.9 A, 40 V, -55 to 175 degC, 6-Pin TSOP, RoHS, Tape and Reel; Manufacturer: International Rectifier; PartNumber: PMN50XP-VB; Rated Power Dissipation: 2W; Qg Gate Charge: 25nC; Drain-to-Source Voltage [Vdss]: 40V; Drain-Source On Resistance-Max: 112mO; Channel Type: P-Channel; Package Description: 6-Pin Thin Small Outline Package, Body 3 x 1.65 mm, Pitch 1.00 mm; Datasheet URL: https://www.vishay.com/docs/65332/sq3419aeev.pdf; Mounting Technology: SurfaceMount; Package Reference: TSOP-6; Manufacturer URL: https://www.vishay.com/; Datasheet Version: 04/2010
R99 R101 = Resistor_0603: Resistor, Standard; PartNumber: RC0603FR-0710KL; TempCo: [tempco]; Tolerance: tol; ComponentLink1URL: *; ComponentLink1Description: Datasheet; Value: 10K; SupplierDescription: RES SMD 0 OHM JUMPER 1/10W 0603
R100 = Resistor_0603: Resistor, Standard; PartNumber: RC0603FR-071KL; TempCo: [tempco]; Tolerance: tol; ComponentLink1URL: *; ComponentLink1Description: Datasheet; Value: 1k/1%; SupplierDescription: RES SMD 0 OHM JUMPER 1/10W 0603

## Sheet ECAT RJ45.SchDoc
size 431 x 279 mm; SheetNumber: 7; PageSetup: Record=PageOptions|CenterHorizontal=True|CenterVertical=True|PrintScale=0.96|XCorrection=1.00|YCorrection=1.00|PrintKind=1|BorderSize=5000000|LeftOffset=0|BottomOffset=0|Orientation=2|PaperLength=1000|PaperWidth=1000|Scale=100|PaperSource=258|PrintQuality=600|MediaType=1|DitherType=10|PaperKind=11x17|PrintScaleMode=1; CopyrightDate: 20xx
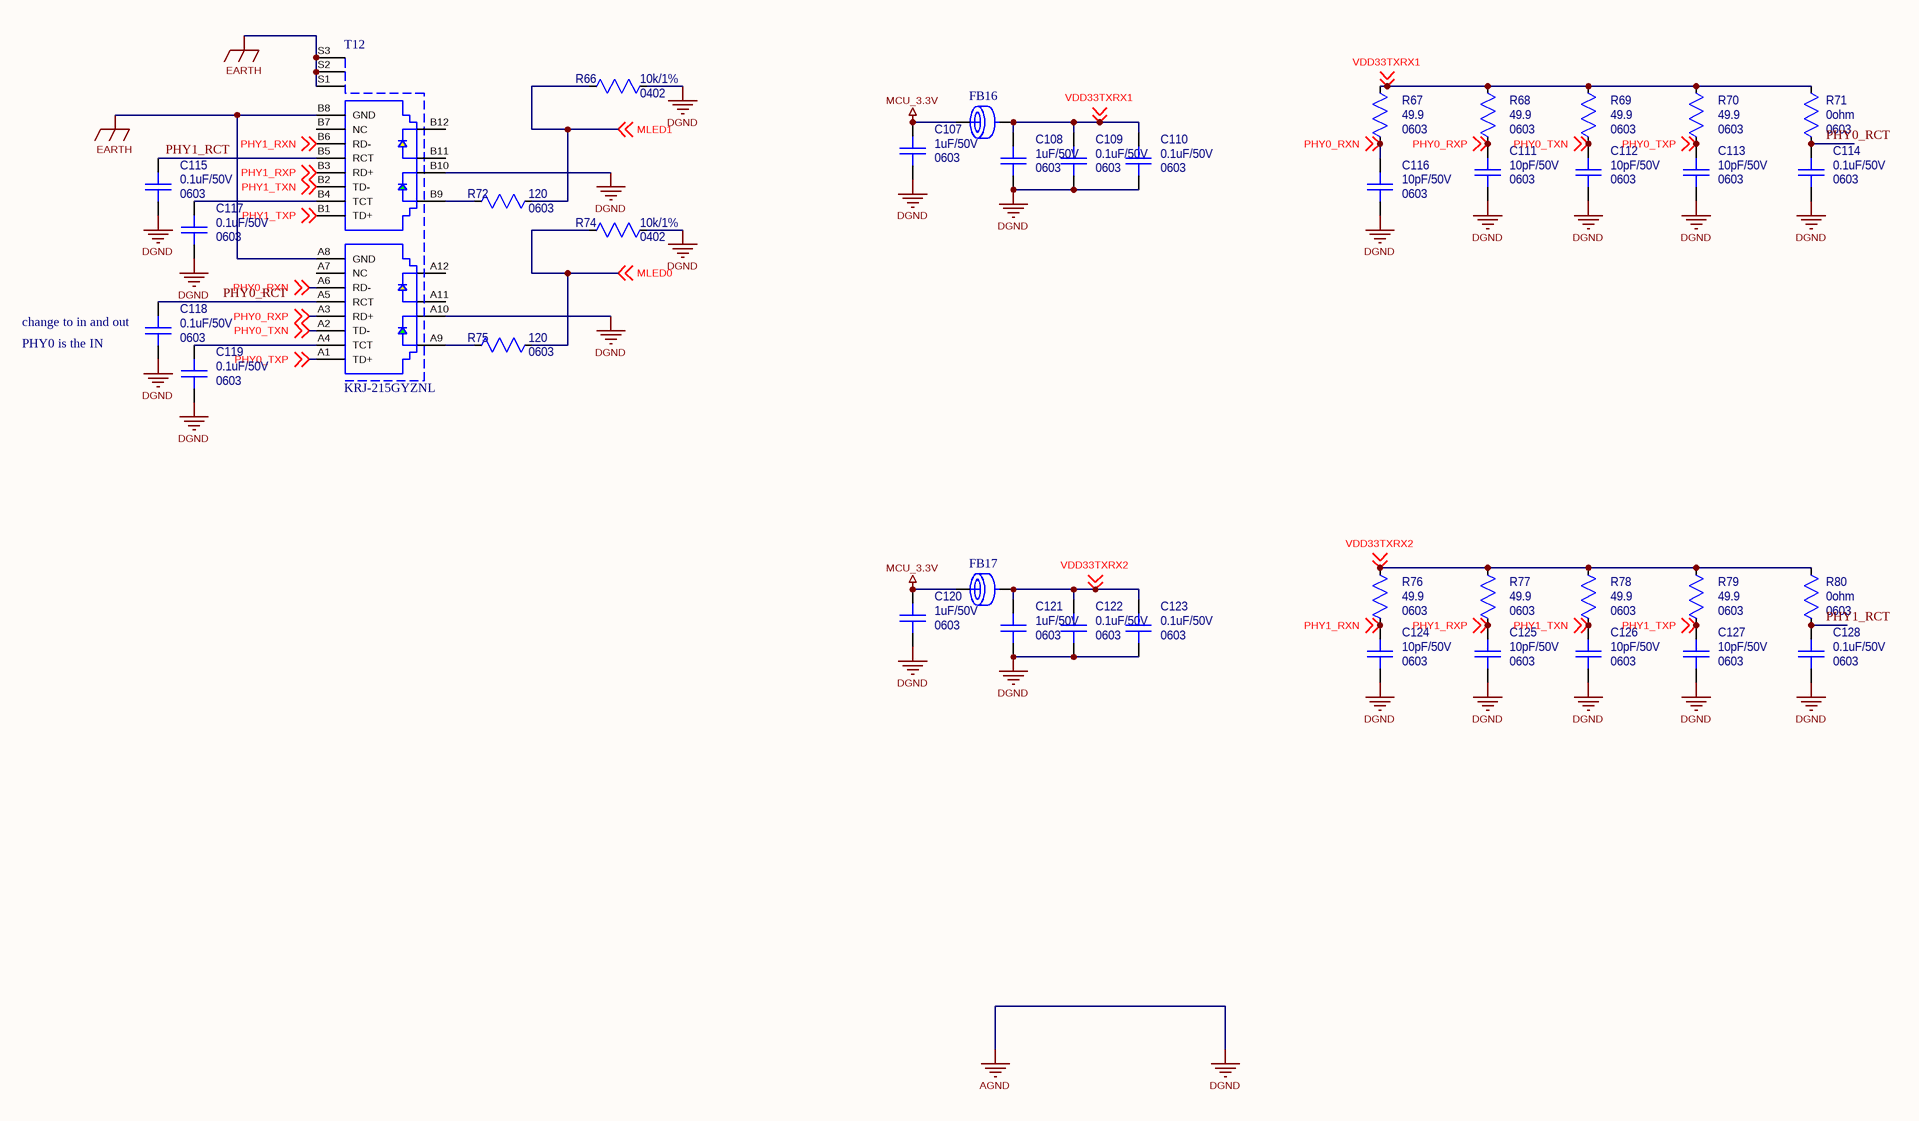
[diagram p6: ECAT RJ45.SchDoc]

### Parts
C107  Package: 0603  [CAPC1608X092N_0603]  (hidden comment: 1uF/50V)
C108  Package: 0603  [CAPC1608X092N_0603]  (hidden comment: 1uF/50V)
C109  Package: 0603  [CAPC1608X092N_0603]  (hidden comment: 0.1uF/50V)
C110  Package: 0603  [CAPC1608X092N_0603]  (hidden comment: 0.1uF/50V)
C111  Package: 0603  [CAPC1608X092N_0603]  (hidden comment: 10pF/50V)
C112  Package: 0603  [CAPC1608X092N_0603]  (hidden comment: 10pF/50V)
C113  Package: 0603  [CAPC1608X092N_0603]  (hidden comment: 10pF/50V)
C114  Package: 0603  [CAPC1608X092N_0603]  (hidden comment: 0.1uF/50V)
C115  Package: 0603  [CAPC1608X092N_0603]  (hidden comment: 0.1uF/50V)
C116  Package: 0603  [CAPC1608X092N_0603]  (hidden comment: 10pF/50V)
C117  Package: 0603  [CAPC1608X092N_0603]  (hidden comment: 0.1uF/50V)
C118  Package: 0603  [CAPC1608X092N_0603]  (hidden comment: 0.1uF/50V)
C119  Package: 0603  [CAPC1608X092N_0603]  (hidden comment: 0.1uF/50V)
C120  Package: 0603  [CAPC1608X092N_0603]  (hidden comment: 1uF/50V)
C121  Package: 0603  [CAPC1608X092N_0603]  (hidden comment: 1uF/50V)
C122  Package: 0603  [CAPC1608X092N_0603]  (hidden comment: 0.1uF/50V)
C123  Package: 0603  [CAPC1608X092N_0603]  (hidden comment: 0.1uF/50V)
C124  Package: 0603  [CAPC1608X092N_0603]  (hidden comment: 10pF/50V)
C125  Package: 0603  [CAPC1608X092N_0603]  (hidden comment: 10pF/50V)
C126  Package: 0603  [CAPC1608X092N_0603]  (hidden comment: 10pF/50V)
C127  Package: 0603  [CAPC1608X092N_0603]  (hidden comment: 10pF/50V)
C128  Package: 0603  [CAPC1608X092N_0603]  (hidden comment: 0.1uF/50V)
FB16  FBC0603  [FBC0603]  (value not drawn)
FB17  FBC0603  [FBC0603]  (value not drawn)
R66  Package: 0402  [RESC1005X040N_0402]  (hidden comment: 10k/1%)
R67  Package: 0603  [RESC1608X055N_0603]  (hidden comment: 49.9)
R68  Package: 0603  [RESC1608X055N_0603]  (hidden comment: 49.9)
R69  Package: 0603  [RESC1608X055N_0603]  (hidden comment: 49.9)
R70  Package: 0603  [RESC1608X055N_0603]  (hidden comment: 49.9)
R71  Package: 0603  [RESC1608X055N_0603]  (hidden comment: 0ohm)
R72  Package: 0603  [RESC1608X055N_0603]  (hidden comment: 120)
R74  Package: 0402  [RESC1005X040N_0402]  (hidden comment: 10k/1%)
R75  Package: 0603  [RESC1608X055N_0603]  (hidden comment: 120)
R76  Package: 0603  [RESC1608X055N_0603]  (hidden comment: 49.9)
R77  Package: 0603  [RESC1608X055N_0603]  (hidden comment: 49.9)
R78  Package: 0603  [RESC1608X055N_0603]  (hidden comment: 49.9)
R79  Package: 0603  [RESC1608X055N_0603]  (hidden comment: 49.9)
R80  Package: 0603  [RESC1608X055N_0603]  (hidden comment: 0ohm)
T12  KRJ-215GYZNL  [DGKYD-KRJ-211_V]

### Nets
AGND: C107.2 C108.2 C109.2 C110.2 C111.2 C112.2 C113.2 C114.2 C115.2 C116.2 C117.2 C118.2 C119.2 C120.2 C121.2 C122.2 C123.2 C124.2 C125.2 C126.2 C127.2 C128.2 R66.1 R74.1 T12.A10 T12.B10  [also labelled DGND]
EARTH: T12.A8(GND) T12.B8(GND) T12.S1(Shield) T12.S2(Shield) T12.S3(Shield)
MCU_3.3V: C107.1 C120.1 FB16.1 FB17.1
MLED0: R74.2 R75.1 ; off-sheet MLED0
MLED1: R66.2 R72.1 ; off-sheet MLED1
PHY0_RCT: C114.1 C118.1 R71.2 T12.A5(RCT)
PHY0_RXN: C116.1 R67.1 T12.A6(RD-) ; off-sheet PHY0_RXN  [project net PHY0_RX_N]
PHY0_RXP: C111.1 R68.1 T12.A3(RD+) ; off-sheet PHY0_RXP  [project net PHY0_RX_P]
PHY0_TXN: C112.1 R69.1 T12.A2(TD-) ; off-sheet PHY0_TXN  [project net PHY0_TX_N]
PHY0_TXP: C113.1 R70.1 T12.A1(TD+) ; off-sheet PHY0_TXP  [project net PHY0_TX_P]
PHY1_RCT: C115.1 C128.1 R80.2 T12.B5(RCT)
PHY1_RXN: C124.1 R76.1 T12.B6(RD-) ; off-sheet PHY1_RXN  [project net PHY1_RX_N]
PHY1_RXP: C125.1 R77.1 T12.B3(RD+) ; off-sheet PHY1_RXP  [project net PHY1_RX_P]
PHY1_TXN: C126.1 R78.1 T12.B2(TD-) ; off-sheet PHY1_TXN  [project net PHY1_TX_N]
PHY1_TXP: C127.1 R79.1 T12.B1(TD+) ; off-sheet PHY1_TXP  [project net PHY1_TX_P]
VDD33TXRX1: C108.1 C109.1 C110.1 FB16.2 R67.2 R68.2 R69.2 R70.2 R71.1 ; off-sheet VDD33TXRX1
VDD33TXRX2: C121.1 C122.1 C123.1 FB17.2 R76.2 R77.2 R78.2 R79.2 R80.1 ; off-sheet VDD33TXRX2
NetC117_1: C117.1 T12.B4(TCT)
NetC119_1: C119.1 T12.A4(TCT)
NetR72_2: R72.2 T12.B9
NetR75_2: R75.2 T12.A9

Not connected (* = marked no-connect by the designer): T12 A7(NC) A11 A12 B7(NC) B11 B12

### Notes on the sheet
- (near C118) change to in and out
- (near C118) PHY0 is the IN
- DWG. TITLE
- FILE NAME:
- OrangePrecision
- DWG. NO.
- REV.
- DATE PRINTED:
- ENG.
- DWN.
- DATE
- SHEET
- OF

### Library data of the parts
C107 C108 C120 C121 = Capacitor_0603: as C68 on sheet POWER; Supplier 1: *; Supplier Part Number 1: *; Value: 1uF/50V; SupplierDescription: CAP CER 1UF 25V X5R 0603
C109 C110 C114 C122 C123 C128 = Capacitor_0402: as C4 on sheet E_CAT; Supplier 1: *; Supplier Part Number 1: *; Value: 0.1uF/50V; SupplierDescription: CAP CER 0.1UF 16V X7R 0402
C111-C113 C116 C124-C127 = Capacitor_0603: as C39 on sheet E_CAT; Supplier 1: *; Supplier Part Number 1: *; Value: 10pF/50V; SupplierDescription: CAP CER 10PF 50V C0G/NPO 0603
C115 C117-C119 = Capacitor_0603: as C25 on sheet POWER; Power Rating: *; Value: 0.1uF/50V; SupplierDescription: CAP CER 0.1UF 50V X7R 0603
FB16 FB17 = FBC0603: as FB2 on sheet POWER; SupplierDescription: FERRITE BEAD 600 OHM 0603 1LN
R66 R74 = Resistor_0402: as R17 on sheet E_CAT; Value: 10k/1%; SupplierDescription: RES SMD 10K OHM 1% 1/10W 0402
R67-R70 R76-R79 = Resistor_0603: PartNumber: 0603WAF499JT5E; Power Rating: [power]; TempCo: [tempco]; Tolerance: tol; Value: 49.9; SupplierDescription: RES SMD 49.9 OHM 1% 1/10W 0603
R71 R80 = Resistor_0603: PartNumber: RC0603JR-070RL; Power Rating: [power]; TempCo: [tempco]; Tolerance: tol; Value: 0ohm; SupplierDescription: RES SMD 0 OHM JUMPER 1/10W 0603
R72 R75 = Resistor_0603: PartNumber: RC0603FR-07120RL; Power Rating: [power]; TempCo: [tempco]; Tolerance: tol; Value: 120; SupplierDescription: RES SMD 120 OHM 1% 1/10W 0603
T12 = KRJ-215GYZNL: Part Number: KRJ-211GYNL; Tab: Down; Port Number: 1x2; PoE: non-PoE; USB: No; Shield Tabs: Yes; Published Date: July 2019; Publisher: DGKYD; Operating Temperature: 0 to +70degC; Mounting Technology: THT; Packaging: Tube; Value: KRJ-215GYZNL; PartNumber: KRJ-215GYZNL

## Nets that join several sheets
5V_DNET: POWER (C53.1 C54.1 FB5.2), CAN (7 pins)
24V_F: POWER (R109.1 R111.1), connector (P2.6 Q5.4 R99.1)
+6.5V: POWER (5 pins), connector (T1.1)
+7.5V: POWER (C35.1 FB2.2 FB4.1), E_CAT (FB10.1), connector (T3.1)
AGND: POWER (48 pins), CAN (5 pins), E_CAT (40 pins), RS485 (C100.1 D78.1 D79.1 U19.5), RS232 (C95.2 C96.2 C99.2 U7.15), connector (P15.4 P16.4 Q4.2 T5.1), ECAT RJ45 (26 pins)
EARTH: POWER (C24.2 C59.2), CAN (C48.2 C49.2), connector (T6.1 T7.1 T9.1 T10.1), ECAT RJ45 (5 pins)
ISO_PGND: POWER (14 pins), CAN (8 pins), connector (T8.1)
MCU_3.3V: POWER (C73.1 C76.1 L1.2 R8.2), CAN (5 pins), RS485 (FB13.2 R116.2), RS232 (FB8.2), connector (P15.5 P16.5 T2.1), ECAT RJ45 (C107.1 C120.1 FB16.1 FB17.1)
V_Power: POWER (F5.2 FB11.1), connector (T4.1)
Vin: POWER (C31.1 C59.1 L4.1), connector (P4.1)
Vin_RTN: POWER (C24.1 C31.2 L4.2), connector (P2.3 P4.2)
232_rxd1: RS232 (U7.13), connector (P2.2)
232_txd1: RS232 (U7.14), connector (P2.1)
232_txd2: RS232 (U7.7), connector (P2.5)
CAN_N: CAN (C48.1 U6.6), connector (P4.3)
CAN_P: CAN (C49.1 U6.7), connector (P4.4)
MLED0: E_CAT (U2.48), ECAT RJ45 (R74.2 R75.1)
MLED1: E_CAT (U2.46), ECAT RJ45 (R66.2 R72.1)
PHY0_RX_N: E_CAT (U2.54), ECAT RJ45 (C116.1 R67.1 T12.A6)
PHY0_RX_P: E_CAT (U2.55), ECAT RJ45 (C111.1 R68.1 T12.A3)
PHY0_TX_N: E_CAT (U2.52), ECAT RJ45 (C112.1 R69.1 T12.A2)
PHY0_TX_P: E_CAT (U2.53), ECAT RJ45 (C113.1 R70.1 T12.A1)
PHY1_RX_N: E_CAT (U2.60), ECAT RJ45 (C124.1 R76.1 T12.B6)
PHY1_RX_P: E_CAT (U2.61), ECAT RJ45 (C125.1 R77.1 T12.B3)
PHY1_TX_N: E_CAT (U2.63), ECAT RJ45 (C126.1 R78.1 T12.B2)
PHY1_TX_P: E_CAT (U2.62), ECAT RJ45 (C127.1 R79.1 T12.B1)
RS485_N: RS485 (D79.2 F7.2 R110.1), connector (P4.5)
RS485_P: RS485 (D78.2 F8.2 R110.2), connector (P4.6)
RUN: E_CAT (U2.45), connector (P16.3)
VDD33TXRX1: E_CAT (U2.51), ECAT RJ45 (9 pins)
VDD33TXRX2: E_CAT (U2.64), ECAT RJ45 (9 pins)